# Altium schematic sheet RK3566.SchDoc
size A0; SheetNumber: 13; SheetTotal: 22
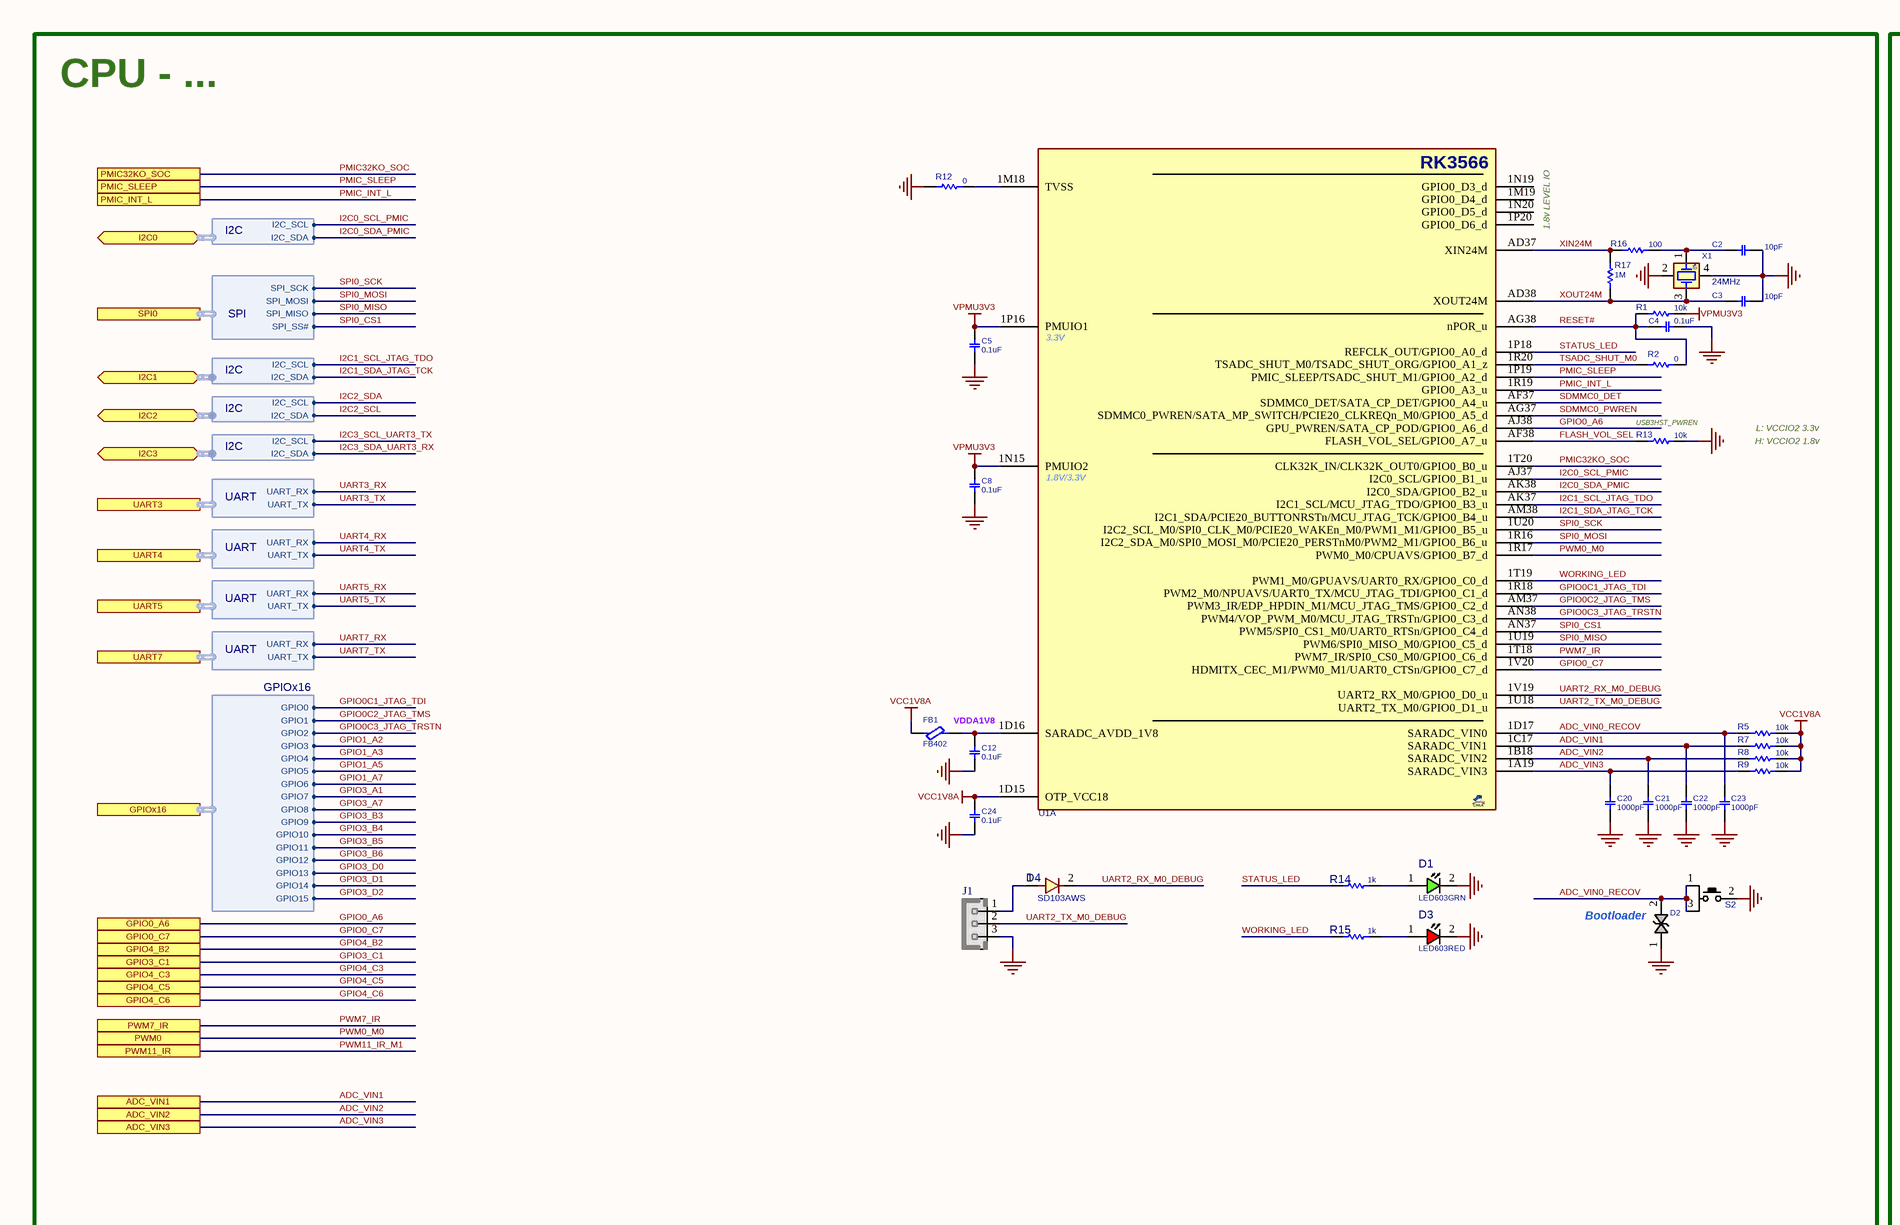
[diagram p0: RK3566.SchDoc, top left]
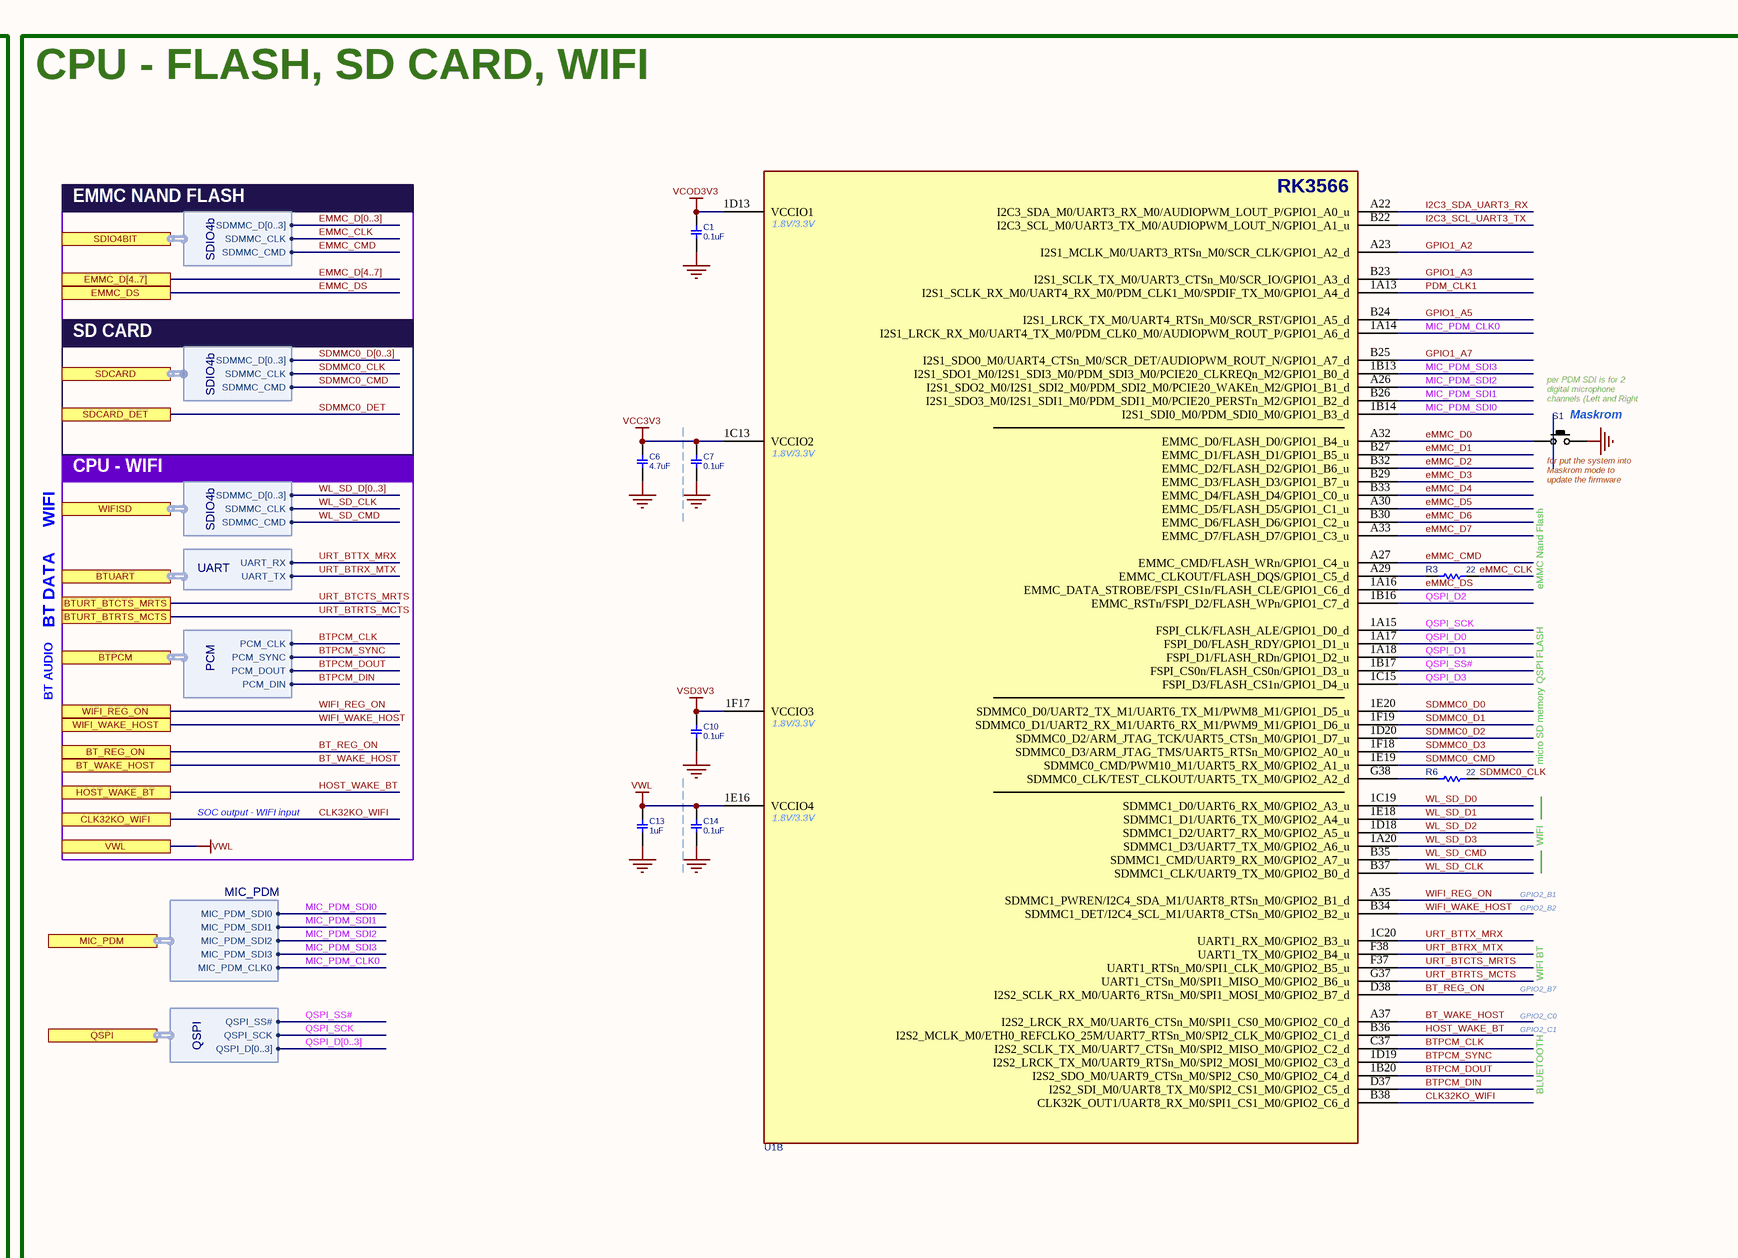
[diagram p1: RK3566.SchDoc, top middle]
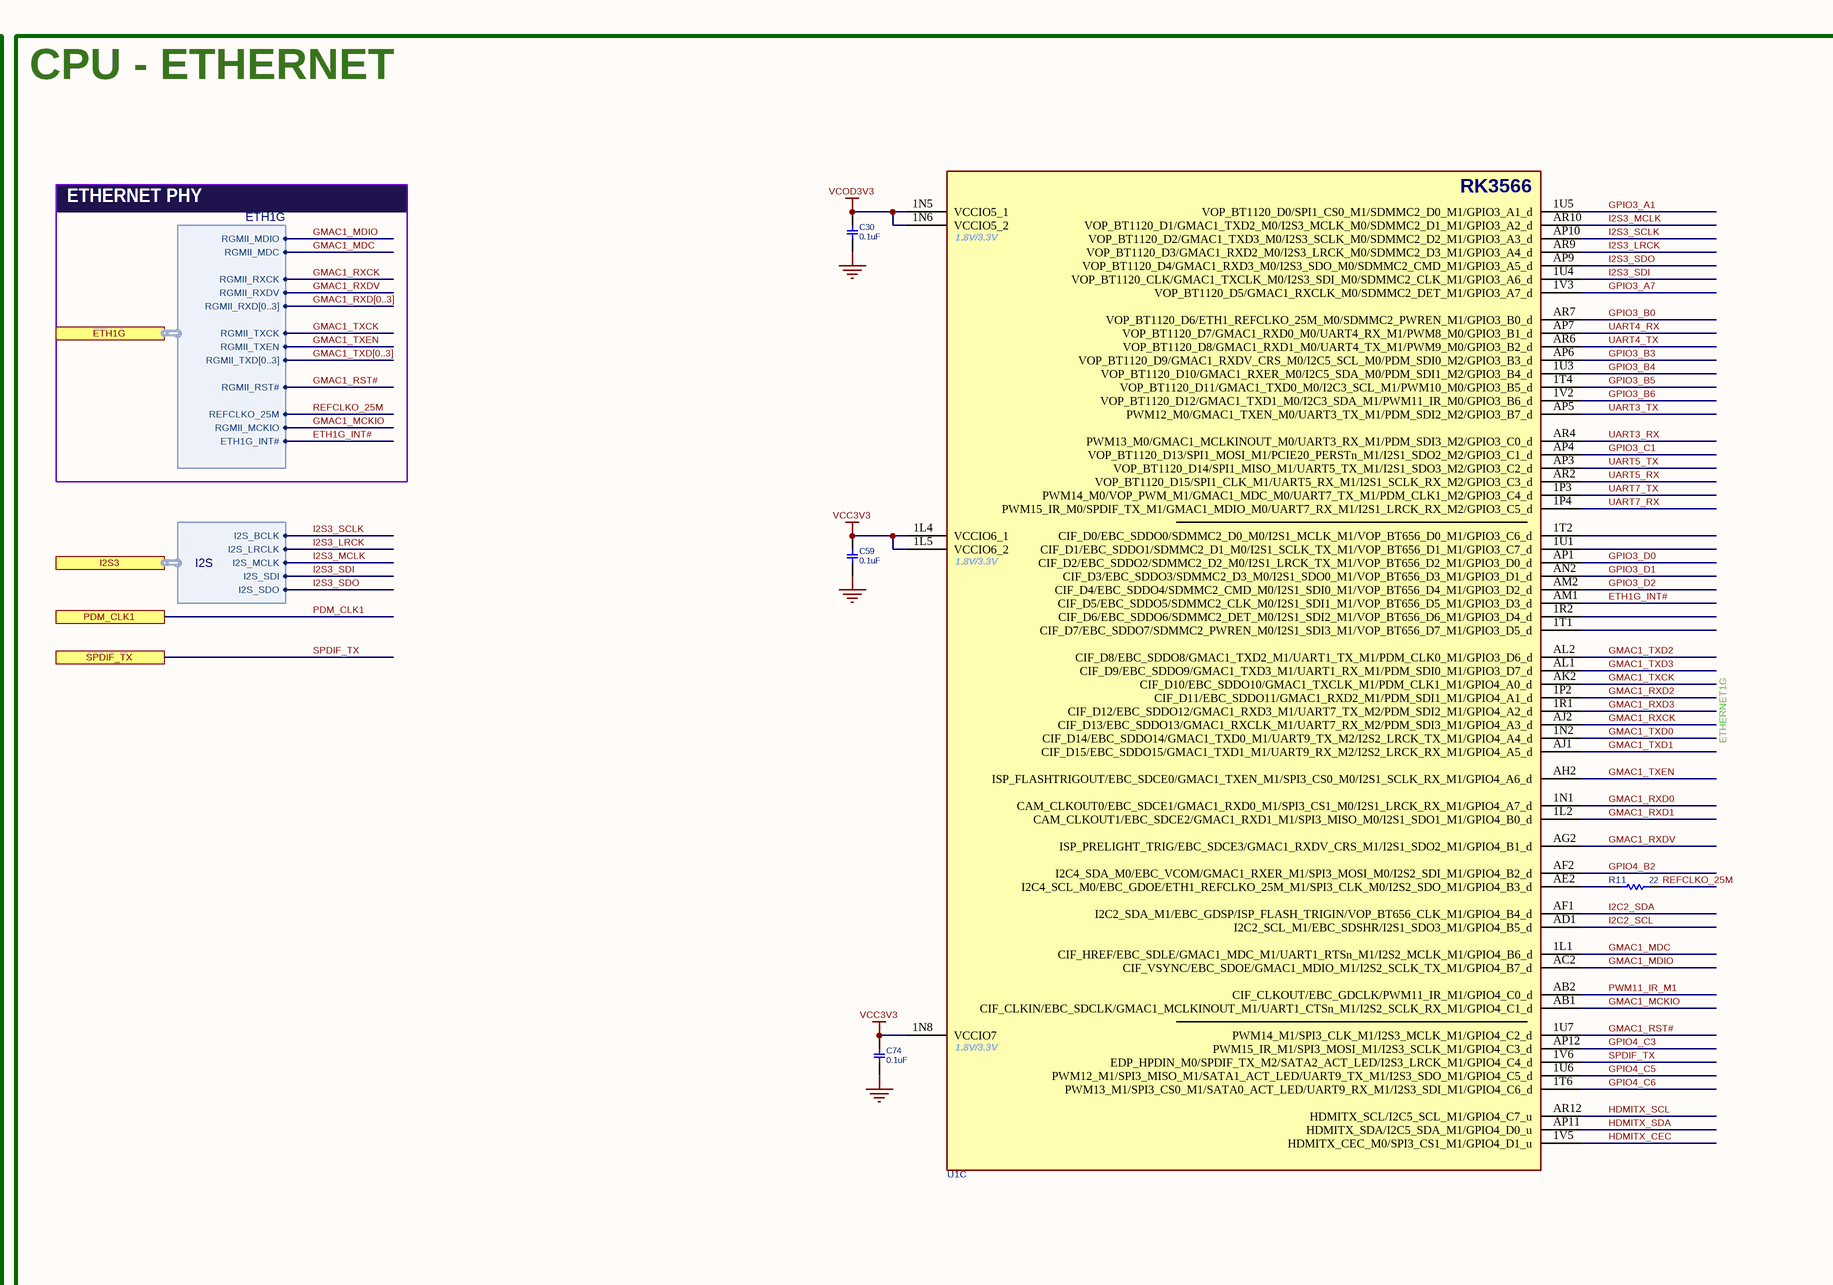
[diagram p2: RK3566.SchDoc, top right]
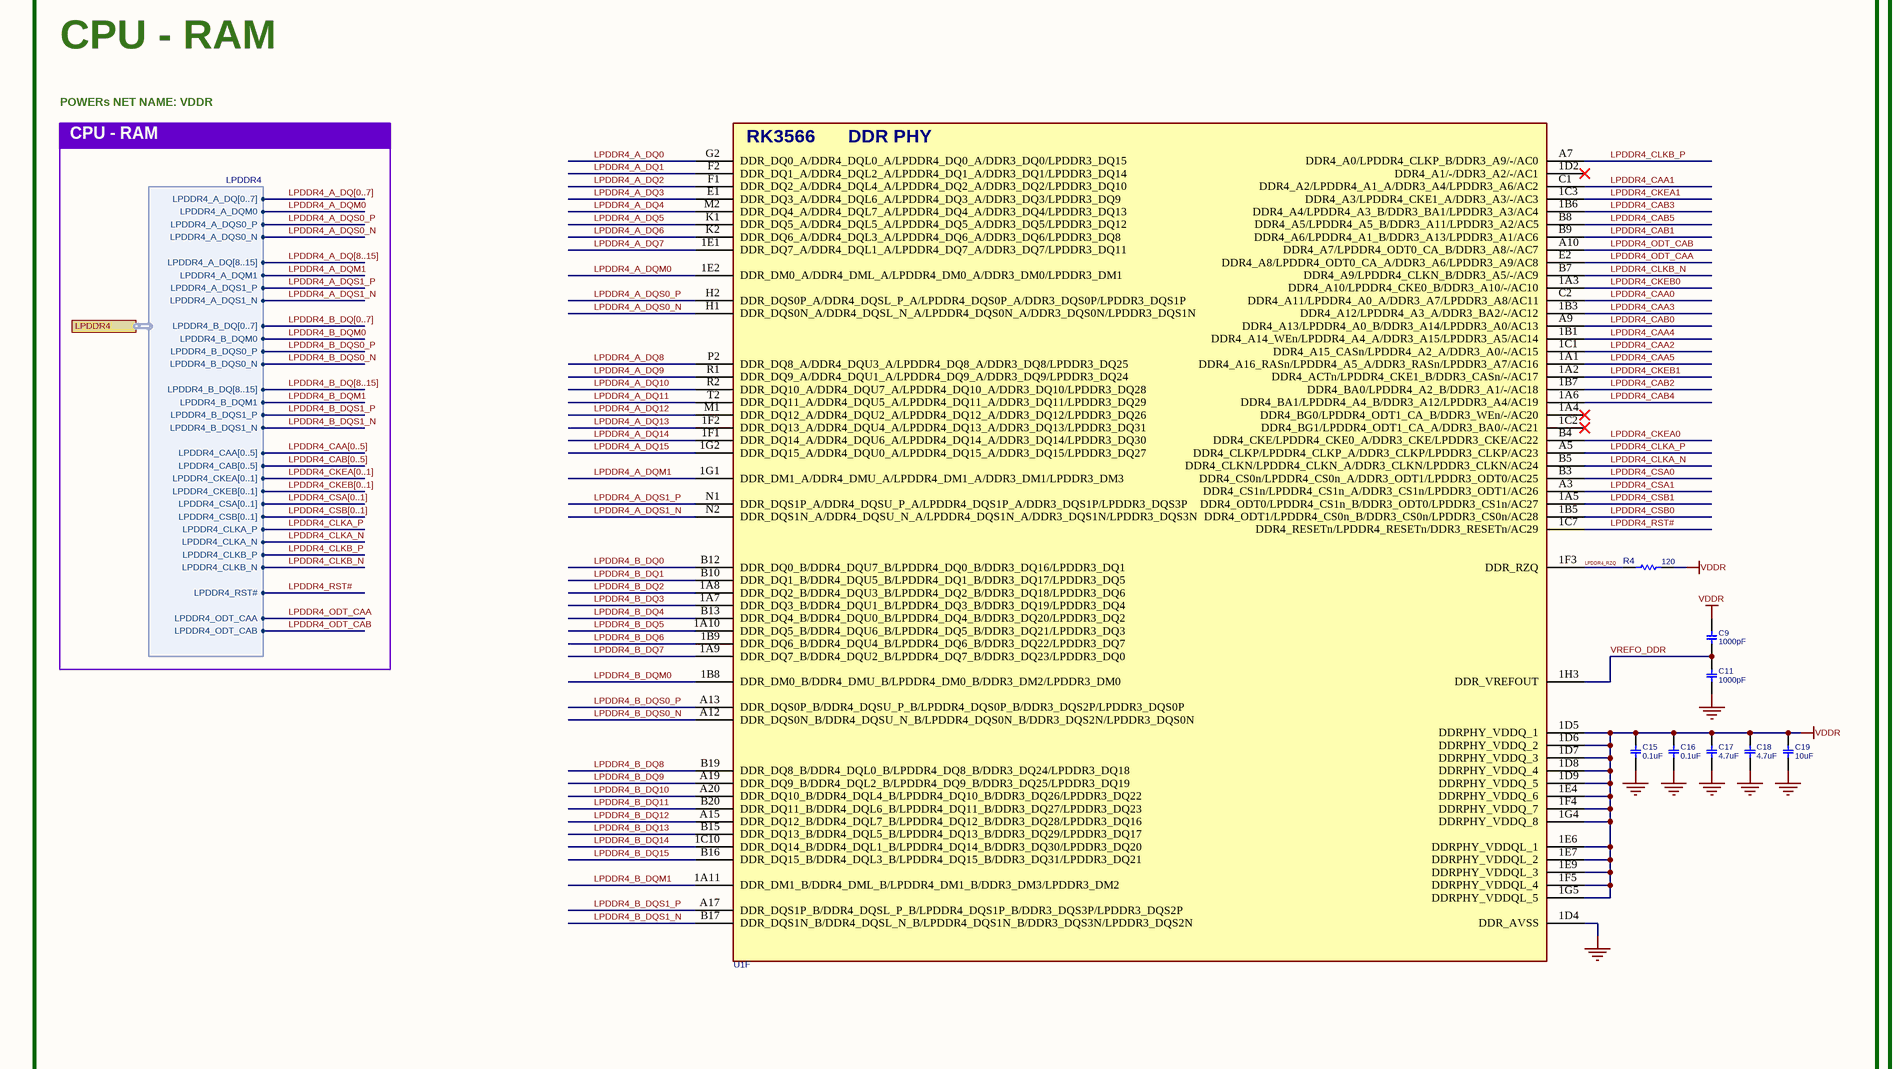
[diagram p3: RK3566.SchDoc, bottom left]
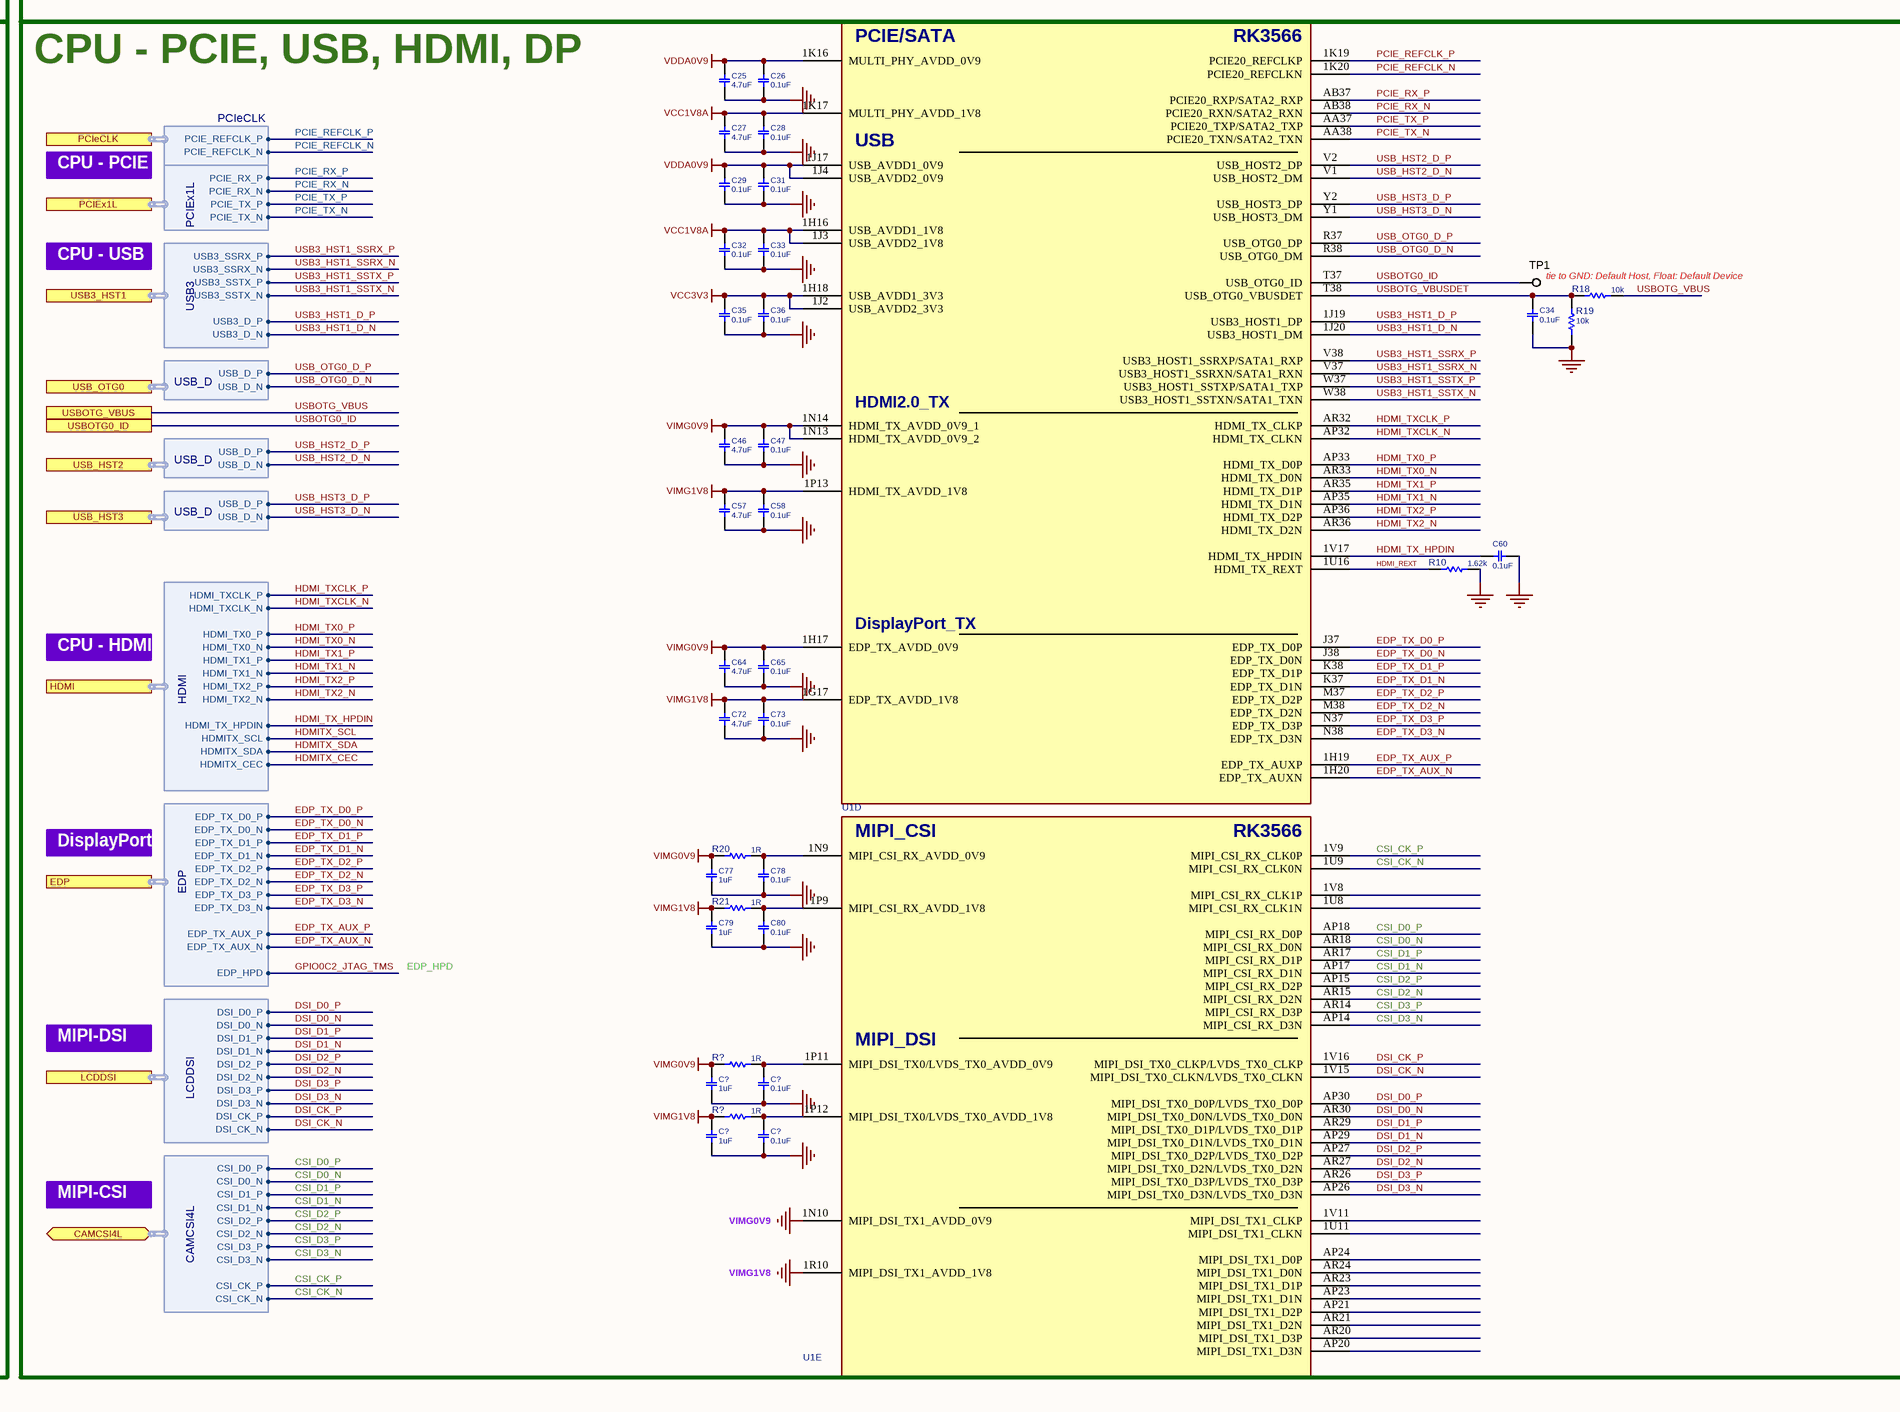
[diagram p4: RK3566.SchDoc, bottom middle]
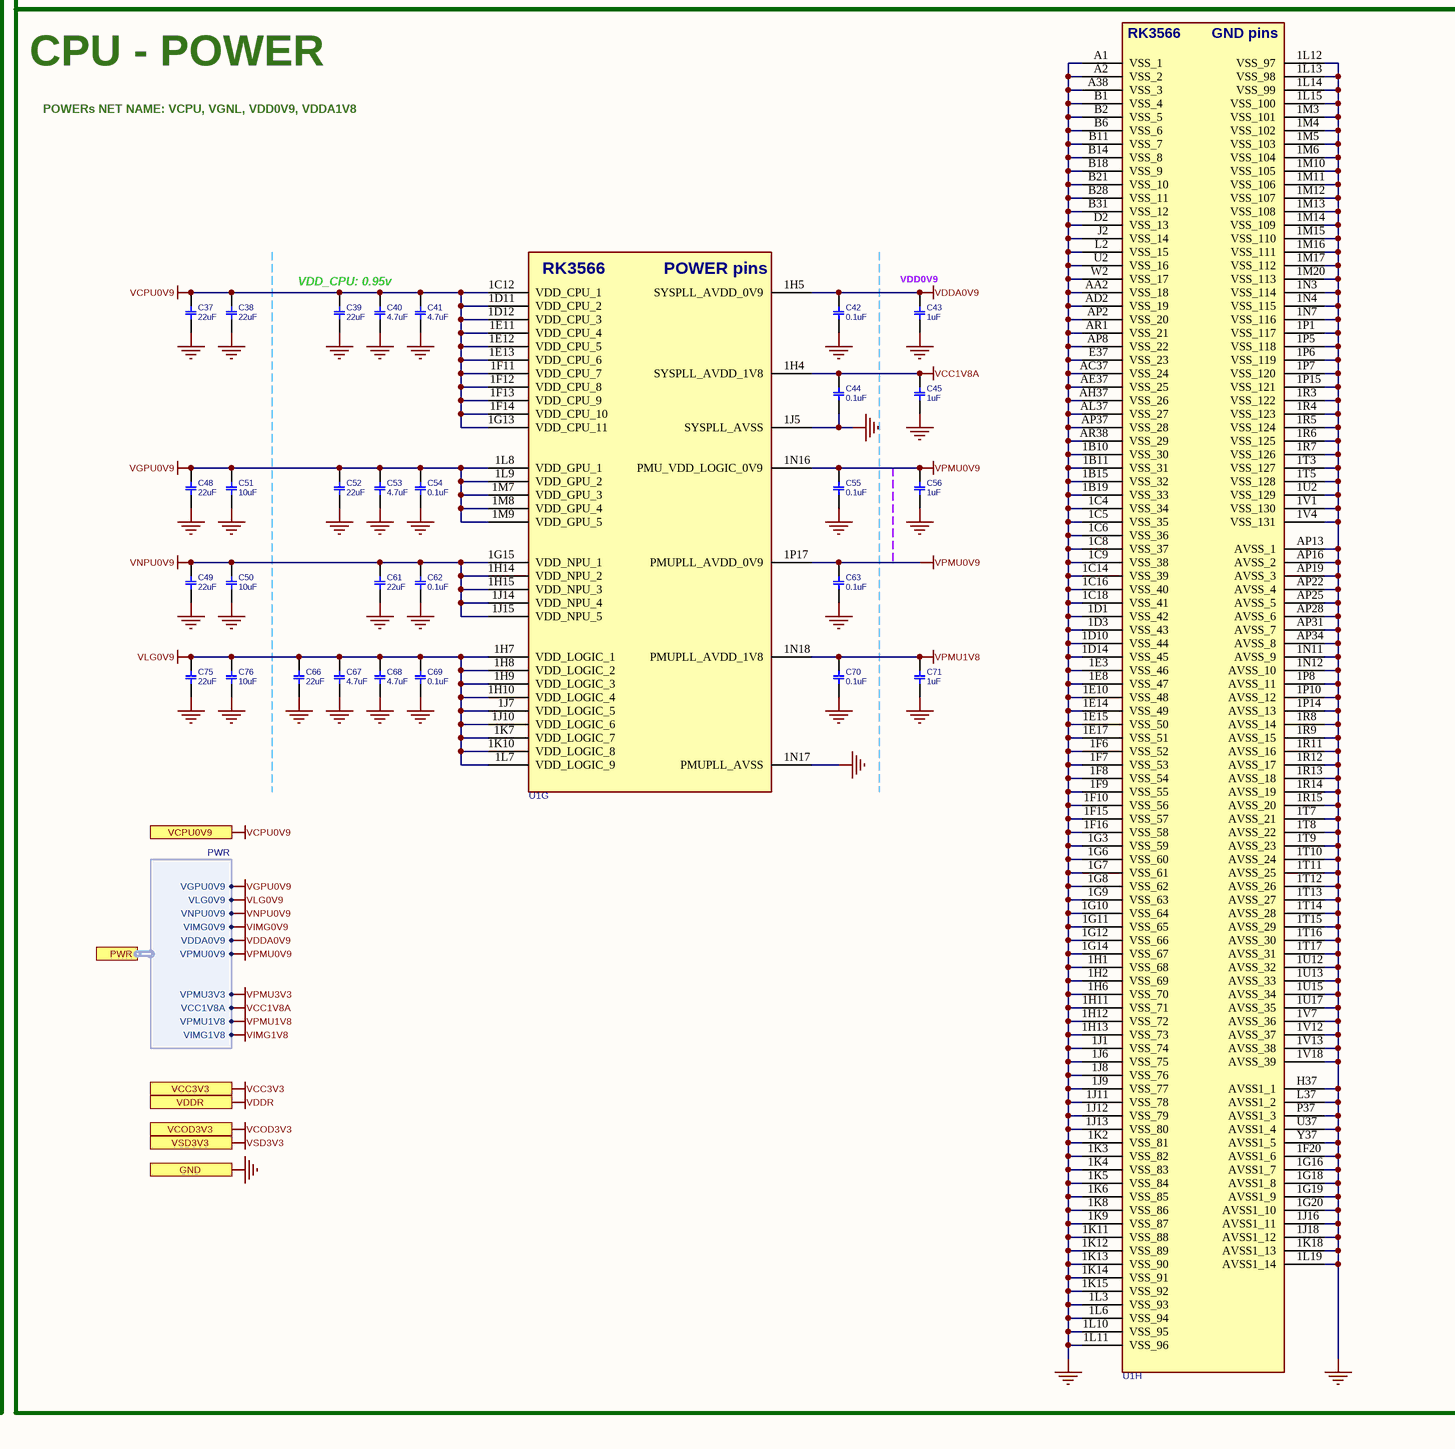
[diagram p5: RK3566.SchDoc, bottom right]

## Parts
(Parts that share a designator on the sheet are numbered #1, #2 ... from top to bottom, then left to right.)
C1  0.1uF  [C0201]
C2  10pF  [C0402A]
C3  10pF  [C0402A]
C4  0.1uF  [C0402A]
C5  0.1uF  [C0201]
C6  4.7uF  [C0201]
C7  0.1uF  [C0201]
C8  0.1uF  [C0201]
C9  1000pF  [C0201]
C10  0.1uF  [C0201]
C11  1000pF  [C0201]
C12  0.1uF  [C0201]
C13  1uF  [C0201]
C14  0.1uF  [C0201]
C15  0.1uF  [C0201]
C16  0.1uF  [C0201]
C17  4.7uF  [C0201]
C18  4.7uF  [C0201]
C19  10uF  [C0402A]
C20  1000pF  [C0201]
C21  1000pF  [C0201]
C22  1000pF  [C0201]
C23  1000pF  [C0201]
C24  0.1uF  [C0201]
C25  4.7uF  [C0201]
C26  0.1uF  [C0201]
C27  4.7uF  [C0201]
C28  0.1uF  [C0201]
C29  0.1uF  [C0201]
C30  0.1uF  [C0201]
C31  0.1uF  [C0201]
C32  0.1uF  [C0201]
C33  0.1uF  [C0201]
C34  0.1uF  [C0402A]
C35  0.1uF  [C0201]
C36  0.1uF  [C0201]
C37  22uF  [C0402A]
C38  22uF  [C0402A]
C39  22uF  [C0402A]
C40  4.7uF  [C0201]
C41  4.7uF  [C0201]
C42  0.1uF  [C0201]
C43  1uF  [C0201]
C44  0.1uF  [C0201]
C45  1uF  [C0201]
C46  4.7uF  [C0201]
C47  0.1uF  [C0201]
C48  22uF  [C0402A]
C49  22uF  [C0402A]
C50  10uF  [C0402A]
C51  10uF  [C0402A]
C52  22uF  [C0402A]
C53  4.7uF  [C0201]
C54  0.1uF  [C0201]
C55  0.1uF  [C0201]
C56  1uF  [C0201]
C57  4.7uF  [C0201]
C58  0.1uF  [C0201]
C59  0.1uF  [C0201]
C60  0.1uF  [C0201]
C61  22uF  [C0402A]
C62  0.1uF  [C0201]
C63  0.1uF  [C0201]
C64  4.7uF  [C0201]
C65  0.1uF  [C0201]
C66  22uF  [C0402A]
C67  4.7uF  [C0201]
C68  4.7uF  [C0201]
C69  0.1uF  [C0201]
C70  0.1uF  [C0201]
C71  1uF  [C0201]
C72  4.7uF  [C0201]
C73  0.1uF  [C0201]
C74  0.1uF  [C0201]
C75  22uF  [C0402A]
C76  10uF  [C0402A]
C77  1uF  [C0201]
C78  0.1uF  [C0201]
C79  1uF  [C0201]
C80  0.1uF  [C0201]
C?#1  1uF  [C0201]
C?#2  0.1uF  [C0201]
C?#3  1uF  [C0201]
C?#4  0.1uF  [C0201]
D1  LED603GRN  [LED0603GRN]
D2  TVS_PESDNC2FD3V3  [ESD0402]  (value not drawn)
D3  LED603RED  [LED0603RED]
D4  SD103AWS  [D_SOD323]
FB1  FB402  [L0402A]
J1  HHDR_3  [XH_3]  (value not drawn)
R1  10k  [R0402A]
R2  0  [R0402A]
R3  22  [R0402]
R4  120  [R0402A]
R5  10k  [R0402A]
R6  22  [R0402]
R7  10k  [R0402A]
R8  10k  [R0402A]
R9  10k  [R0402A]
R10  1.62k  [R0402A]
R11  22  [R0402]
R12  0  [R0402A]
R13  10k  [R0402A]
R14  1k  [R0402A]
R15  1k  [R0402A]
R16  100  [R0402A]
R17  1M  [R0402A]
R18  10k  [R0402A]
R19  10k  [R0402A]
R20  1R  [R0402A]
R21  1R  [R0402A]
R?#1  1R  [R0402A]
R?#2  1R  [R0402A]
S1  PUSHBUTTON  [SWPBS_SPST_3X2X1]  (value not drawn)
S2  PUSHBUTTON  [SWPBS_SPDT_R_SKRTLA]  (value not drawn)
TP1  TESTPOINT_SMD  [TPSMD_S1]  (value not drawn)  (no BOM)
U1  RK3566  [BGA65_565]  (value not drawn)  (parts A,B,C,D,E,F,G,H of 8)
X1  24MHz  [XTL_4_2016]

## Blocks framed on the sheet
CPU - ...: C2-C5 C8 C12 C20-C24 D1-D4 FB1 J1 R1 R2 R5 R7-R9 R12-R17 S2 U1 X1
CPU - FLASH, SD CARD, WIFI: C1 C6 C7 C10 C13 C14 R3 R6 S1 U1
CPU - ETHERNET: C30 C59 C74 R11 U1
CPU - RAM: C9 C11 C15-C19 R4 U1
CPU - PCIE, USB, HDMI, DP: C25-C29 C31-C36 C46 C47 C57 C58 C60 C64 C65 C72 C73 C77-C80 C?#1-C?#4 R10 R18-R21 R?#1 R?#2 TP1 U1
CPU - POWER: C37-C45 C48-C56 C61-C63 C66-C71 C75 C76 U1

## Ports
ADC_VIN1, ADC_VIN2, ADC_VIN3, BT_REG_ON, BT_WAKE_HOST, BTPCM (harness PCM), BTUART (harness UART), BTURT_BTCTS_MRTS, BTURT_BTRTS_MCTS, CAMCSI4L (bidir, harness CAMCSI4L), CLK32KO_WIFI, EDP (harness EDP), EMMC_D[4..7], EMMC_DS, ETH1G (harness ETH1G), GND, GPIO0_A6, GPIO0_C7, GPIO3_C1, GPIO4_B2, GPIO4_C3, GPIO4_C5, GPIO4_C6, GPIOx16 (harness GPIOx16), HDMI (harness HDMI), HOST_WAKE_BT, I2C0 (bidir, harness I2C), I2C1 (bidir, harness I2C), I2C2 (bidir, harness I2C), I2C3 (bidir, harness I2C), I2S3 (harness I2S), LCDDSI (harness LCDDSI), LPDDR4 (harness LPDDR4), MIC_PDM (harness MIC_PDM), PCIeCLK (harness PCIeCLK), PCIEx1L (harness PCIEx1L), PDM_CLK1, PMIC32KO_SOC, PMIC_INT_L, PMIC_SLEEP, PWM0, PWM7_IR, PWM11_IR, PWR (harness PWR), QSPI (harness QSPI), SDCARD (harness SDIO4b), SDCARD_DET, SDIO4BIT (harness SDIO4b), SPDIF_TX, SPI0 (harness SPI), UART3 (harness UART), UART4 (harness UART), UART5 (harness UART), UART7 (harness UART), USB3_HST1 (harness USB3), USB_HST2 (harness USB_D), USB_HST3 (harness USB_D), USB_OTG0 (harness USB_D), USBOTG0_ID, USBOTG_VBUS, VCC3V3, VCOD3V3, VCPU0V9, VDDR, VSD3V3, VWL, WIFI_REG_ON, WIFI_WAKE_HOST, WIFISD (harness SDIO4b)

## Harnesses
LPDDR4: LPDDR4_A_DQ[0..7], LPDDR4_A_DQM0, LPDDR4_A_DQS0_P, LPDDR4_A_DQS0_N, LPDDR4_A_DQ[8..15], LPDDR4_A_DQM1, LPDDR4_A_DQS1_P, LPDDR4_A_DQS1_N, LPDDR4_B_DQ[0..7], LPDDR4_B_DQM0, LPDDR4_B_DQS0_P, LPDDR4_B_DQS0_N, LPDDR4_B_DQ[8..15], LPDDR4_B_DQM1, LPDDR4_B_DQS1_P, LPDDR4_B_DQS1_N, LPDDR4_CAA[0..5], LPDDR4_CAB[0..5], LPDDR4_CKEA[0..1], LPDDR4_CKEB[0..1], LPDDR4_CSA[0..1], LPDDR4_CSB[0..1], LPDDR4_CLKA_P, LPDDR4_CLKA_N, LPDDR4_CLKB_P, LPDDR4_CLKB_N, LPDDR4_RST#, LPDDR4_ODT_CAA, LPDDR4_ODT_CAB
HDMI: HDMI_TXCLK_P, HDMI_TXCLK_N, HDMI_TX0_P, HDMI_TX0_N, HDMI_TX1_P, HDMI_TX1_N, HDMI_TX2_P, HDMI_TX2_N, HDMI_TX_HPDIN, HDMITX_SCL, HDMITX_SDA, HDMITX_CEC
PWR: VGPU0V9, VLG0V9, VNPU0V9, VIMG0V9, VDDA0V9, VPMU0V9, VPMU3V3, VCC1V8A, VPMU1V8, VIMG1V8
EDP: EDP_TX_D0_P, EDP_TX_D0_N, EDP_TX_D1_P, EDP_TX_D1_N, EDP_TX_D2_P, EDP_TX_D2_N, EDP_TX_D3_P, EDP_TX_D3_N, EDP_TX_AUX_P, EDP_TX_AUX_N, EDP_HPD
MIC_PDM: MIC_PDM_SDI0, MIC_PDM_SDI1, MIC_PDM_SDI2, MIC_PDM_SDI3, MIC_PDM_CLK0
USB3: USB3_SSRX_P, USB3_SSRX_N, USB3_SSTX_P, USB3_SSTX_N, USB3_D_P, USB3_D_N
PCIEx1L: PCIE_RX_P, PCIE_RX_N, PCIE_TX_P, PCIE_TX_N
ETH1G: RGMII_MDIO, RGMII_MDC, RGMII_RXCK, RGMII_RXDV, RGMII_RXD[0..3], RGMII_TXCK, RGMII_TXEN, RGMII_TXD[0..3], RGMII_RST#, REFCLKO_25M, RGMII_MCKIO, ETH1G_INT#
CAMCSI4L: CSI_D0_P, CSI_D0_N, CSI_D1_P, CSI_D1_N, CSI_CK_P, CSI_CK_N, CSI_D2_P, CSI_D2_N, CSI_D3_P, CSI_D3_N
LCDDSI: DSI_D0_P, DSI_D0_N, DSI_D1_P, DSI_D1_N, DSI_D2_P, DSI_D2_N, DSI_D3_P, DSI_D3_N, DSI_CK_P, DSI_CK_N
QSPI: QSPI_SS#, QSPI_SCK, QSPI_D[0..3]
SDIO4b: SDMMC_CMD, SDMMC_D[0..3], SDMMC_CLK
USB_D: USB_D_P, USB_D_N
I2C: I2C_SCL, I2C_SDA
SPI: SPI_SCK, SPI_MOSI, SPI_MISO, SPI_SS#
UART: UART_RX, UART_TX
GPIOx16: GPIO0, GPIO1, GPIO2, GPIO3, GPIO4, GPIO5, GPIO6, GPIO7, GPIO8, GPIO9, GPIO10, GPIO11, GPIO12, GPIO13, GPIO14, GPIO15
PCM: PCM_CLK, PCM_SYNC, PCM_DOUT, PCM_DIN
I2S: I2S_BCLK, I2S_LRCLK, I2S_MCLK, I2S_SDI, I2S_SDO
PCIeCLK: PCIE_REFCLK_P, PCIE_REFCLK_N

## Nets
GND: C1.2 C2.2 C3.2 C4.1 C5.2 C6.1 C7.2 C8.2 C10.2 C11.2 C12.2 C13.1 C14.2 C15.1 C16.1 C17.1 C18.1 C19.1 C20.2 C21.2 C22.2 C23.2 C24.2 C25.1 C26.2 C27.1 C28.2 C29.2 C30.2 C31.2 C32.2 C33.2 C34.2 C35.2 C36.2 C37.1 C38.1 C39.1 C40.1 C41.1 C42.1 C43.1 C44.1 C45.1 C46.1 C47.2 C48.1 C49.1 C50.1 C51.1 C52.1 C53.1 C54.1 C55.1 C56.1 C57.1 C58.2 C59.2 C60.2 C61.1 C62.1 C63.1 C64.1 C65.2 C66.1 C67.1 C68.1 C69.1 C70.1 C71.1 C72.1 C73.2 C74.2 C75.1 C76.1 C77.1 C78.1 C79.1 C80.1 C?#1.1 C?#2.1 C?#3.1 C?#4.1 D1.2(CATHODE) D2.1 D3.2(CATHODE) J1.3 R10.1 R12.2 R13.1 R19.2 S1.1(P1) S2.2 U1.1B10(VSS_30) U1.1B11(VSS_31) U1.1B15(VSS_32) U1.1B19(VSS_33) U1.1C4(VSS_34) U1.1C5(VSS_35) U1.1C6(VSS_36) U1.1C8(VSS_37) U1.1C9(VSS_38) U1.1C14(VSS_39) U1.1C16(VSS_40) U1.1C18(VSS_41) U1.1D1(VSS_42) U1.1D3(VSS_43) U1.1D4(DDR_AVSS) U1.1D10(VSS_44) U1.1D14(VSS_45) U1.1E3(VSS_46) U1.1E8(VSS_47) U1.1E10(VSS_48) U1.1E14(VSS_49) U1.1E15(VSS_50) U1.1E17(VSS_51) U1.1F6(VSS_52) U1.1F7(VSS_53) U1.1F8(VSS_54) U1.1F9(VSS_55) U1.1F10(VSS_56) U1.1F15(VSS_57) U1.1F16(VSS_58) U1.1F20(AVSS1_6) U1.1G3(VSS_59) U1.1G6(VSS_60) U1.1G7(VSS_61) U1.1G8(VSS_62) U1.1G9(VSS_63) U1.1G10(VSS_64) U1.1G11(VSS_65) U1.1G12(VSS_66) U1.1G14(VSS_67) U1.1G16(AVSS1_7) U1.1G18(AVSS1_8) U1.1G19(AVSS1_9) U1.1G20(AVSS1_10) U1.1H1(VSS_68) U1.1H2(VSS_69) U1.1H6(VSS_70) U1.1H11(VSS_71) U1.1H12(VSS_72) U1.1H13(VSS_73) U1.1J1(VSS_74) U1.1J5(SYSPLL_AVSS) U1.1J6(VSS_75) U1.1J8(VSS_76) U1.1J9(VSS_77) U1.1J11(VSS_78) U1.1J12(VSS_79) U1.1J13(VSS_80) U1.1J16(AVSS1_11) U1.1J18(AVSS1_12) U1.1K2(VSS_81) U1.1K3(VSS_82) U1.1K4(VSS_83) U1.1K5(VSS_84) U1.1K6(VSS_85) U1.1K8(VSS_86) U1.1K9(VSS_87) U1.1K11(VSS_88) U1.1K12(VSS_89) U1.1K13(VSS_90) U1.1K14(VSS_91) U1.1K15(VSS_92) U1.1K18(AVSS1_13) U1.1L3(VSS_93) U1.1L6(VSS_94) U1.1L10(VSS_95) U1.1L11(VSS_96) U1.1L12(VSS_97) U1.1L13(VSS_98) U1.1L14(VSS_99) U1.1L15(VSS_100) U1.1L19(AVSS1_14) U1.1M3(VSS_101) U1.1M4(VSS_102) U1.1M5(VSS_103) U1.1M6(VSS_104) U1.1M10(VSS_105) U1.1M11(VSS_106) U1.1M12(VSS_107) U1.1M13(VSS_108) U1.1M14(VSS_109) U1.1M15(VSS_110) U1.1M16(VSS_111) U1.1M17(VSS_112) U1.1M20(VSS_113) U1.1N3(VSS_114) U1.1N4(VSS_115) U1.1N7(VSS_116) U1.1N10(MIPI_DSI_TX1_AVDD_0V9) U1.1N11(AVSS_9) U1.1N12(AVSS_10) U1.1N17(PMUPLL_AVSS) U1.1P1(VSS_117) U1.1P5(VSS_118) U1.1P6(VSS_119) U1.1P7(VSS_120) U1.1P8(AVSS_11) U1.1P10(AVSS_12) U1.1P14(AVSS_13) U1.1P15(VSS_121) U1.1R3(VSS_122) U1.1R4(VSS_123) U1.1R5(VSS_124) U1.1R6(VSS_125) U1.1R7(VSS_126) U1.1R8(AVSS_14) U1.1R9(AVSS_15) U1.1R10(MIPI_DSI_TX1_AVDD_1V8) U1.1R11(AVSS_16) U1.1R12(AVSS_17) U1.1R13(AVSS_18) U1.1R14(AVSS_19) U1.1R15(AVSS_20) U1.1T3(VSS_127) U1.1T5(VSS_128) U1.1T7(AVSS_21) U1.1T8(AVSS_22) U1.1T9(AVSS_23) U1.1T10(AVSS_24) U1.1T11(AVSS_25) U1.1T12(AVSS_26) U1.1T13(AVSS_27) U1.1T14(AVSS_28) U1.1T15(AVSS_29) U1.1T16(AVSS_30) U1.1T17(AVSS_31) U1.1U2(VSS_129) U1.1U12(AVSS_32) U1.1U13(AVSS_33) U1.1U15(AVSS_34) U1.1U17(AVSS_35) U1.1V1(VSS_130) U1.1V4(VSS_131) U1.1V7(AVSS_36) U1.1V12(AVSS_37) U1.1V13(AVSS_38) U1.1V18(AVSS_39) U1.A1(VSS_1) U1.A2(VSS_2) U1.A38(VSS_3) U1.AA2(VSS_18) U1.AC37(VSS_24) U1.AD2(VSS_19) U1.AE37(VSS_25) U1.AH37(VSS_26) U1.AL37(VSS_27) U1.AP2(VSS_20) U1.AP8(VSS_22) U1.AP13(AVSS_1) U1.AP16(AVSS_2) U1.AP19(AVSS_3) U1.AP22(AVSS_4) U1.AP25(AVSS_5) U1.AP28(AVSS_6) U1.AP31(AVSS_7) U1.AP34(AVSS_8) U1.AP37(VSS_28) U1.AR1(VSS_21) U1.AR38(VSS_29) U1.B1(VSS_4) U1.B2(VSS_5) U1.B6(VSS_6) U1.B11(VSS_7) U1.B14(VSS_8) U1.B18(VSS_9) U1.B21(VSS_10) U1.B28(VSS_11) U1.B31(VSS_12) U1.D2(VSS_13) U1.E37(VSS_23) U1.H37(AVSS1_1) U1.J2(VSS_14) U1.L2(VSS_15) U1.L37(AVSS1_2) U1.P37(AVSS1_3) U1.U2(VSS_16) U1.U37(AVSS1_4) U1.W2(VSS_17) U1.Y37(AVSS1_5) X1.2 X1.4 ; port GND
VCC1V8A: C24.1 C27.2 C28.1 C32.1 C33.1 C44.2 C45.2 FB1.1 R5.1 R7.1 R8.1 R9.1 U1.1D15(OTP_VCC18) U1.1H4(SYSPLL_AVDD_1V8) U1.1H16(USB_AVDD1_1V8) U1.1J3(USB_AVDD2_1V8) U1.1K17(MULTI_PHY_AVDD_1V8) ; port PWR.VCC1V8A
VCC3V3: C6.2 C7.1 C35.1 C36.1 C59.1 C74.1 U1.1C13(VCCIO2) U1.1H18(USB_AVDD1_3V3) U1.1J2(USB_AVDD2_3V3) U1.1L4(VCCIO6_1) U1.1L5(VCCIO6_2) U1.1N8(VCCIO7) ; port VCC3V3
VCOD3V3: C1.1 C30.1 U1.1D13(VCCIO1) U1.1N5(VCCIO5_1) U1.1N6(VCCIO5_2) ; port VCOD3V3
VCPU0V9: C37.2 C38.2 C39.2 C40.2 C41.2 U1.1C12(VDD_CPU_1) U1.1D11(VDD_CPU_2) U1.1D12(VDD_CPU_3) U1.1E11(VDD_CPU_4) U1.1E12(VDD_CPU_5) U1.1E13(VDD_CPU_6) U1.1F11(VDD_CPU_7) U1.1F12(VDD_CPU_8) U1.1F13(VDD_CPU_9) U1.1F14(VDD_CPU_10) U1.1G13(VDD_CPU_11) ; port VCPU0V9
VDDA0V9: C25.2 C26.1 C29.1 C31.1 C42.2 C43.2 U1.1H5(SYSPLL_AVDD_0V9) U1.1J4(USB_AVDD2_0V9) U1.1J17(USB_AVDD1_0V9) U1.1K16(MULTI_PHY_AVDD_0V9) ; port PWR.VDDA0V9
VDDR: C9.1 C15.2 C16.2 C17.2 C18.2 C19.2 R4.1 U1.1D5(DDRPHY_VDDQ_1) U1.1D6(DDRPHY_VDDQ_2) U1.1D7(DDRPHY_VDDQ_3) U1.1D8(DDRPHY_VDDQ_4) U1.1D9(DDRPHY_VDDQ_5) U1.1E4(DDRPHY_VDDQ_6) U1.1E6(DDRPHY_VDDQL_1) U1.1E7(DDRPHY_VDDQL_2) U1.1E9(DDRPHY_VDDQL_3) U1.1F4(DDRPHY_VDDQ_7) U1.1F5(DDRPHY_VDDQL_4) U1.1G4(DDRPHY_VDDQ_8) U1.1G5(DDRPHY_VDDQL_5) ; port VDDR
VGPU0V9: C48.2 C51.2 C52.2 C53.2 C54.2 U1.1L8(VDD_GPU_1) U1.1L9(VDD_GPU_2) U1.1M7(VDD_GPU_3) U1.1M8(VDD_GPU_4) U1.1M9(VDD_GPU_5) ; port PWR.VGPU0V9
VIMG0V9: C46.2 C47.1 C64.2 C65.1 C77.2 C?#1.2 R20.1 R?#1.1 U1.1H17(EDP_TX_AVDD_0V9) U1.1N13(HDMI_TX_AVDD_0V9_2) U1.1N14(HDMI_TX_AVDD_0V9_1) ; port PWR.VIMG0V9
VIMG1V8: C57.2 C58.1 C72.2 C73.1 C79.2 C?#3.2 R21.1 R?#2.1 U1.1G17(EDP_TX_AVDD_1V8) U1.1P13(HDMI_TX_AVDD_1V8) ; port PWR.VIMG1V8
VLG0V9: C66.2 C67.2 C68.2 C69.2 C75.2 C76.2 U1.1H7(VDD_LOGIC_1) U1.1H8(VDD_LOGIC_2) U1.1H9(VDD_LOGIC_3) U1.1H10(VDD_LOGIC_4) U1.1J7(VDD_LOGIC_5) U1.1J10(VDD_LOGIC_6) U1.1K7(VDD_LOGIC_7) U1.1K10(VDD_LOGIC_8) U1.1L7(VDD_LOGIC_9) ; port PWR.VLG0V9
VNPU0V9: C49.2 C50.2 C61.2 C62.2 U1.1G15(VDD_NPU_1) U1.1H14(VDD_NPU_2) U1.1H15(VDD_NPU_3) U1.1J14(VDD_NPU_4) U1.1J15(VDD_NPU_5) ; port PWR.VNPU0V9
VPMU0V9: C55.2 C56.2 C63.2 U1.1N16(PMU_VDD_LOGIC_0V9) U1.1P17(PMUPLL_AVDD_0V9) ; port PWR.VPMU0V9
VPMU1V8: C70.2 C71.2 U1.1N18(PMUPLL_AVDD_1V8) ; port PWR.VPMU1V8
VPMU3V3: C5.1 C8.1 R1.1 U1.1N15(PMUIO2) U1.1P16(PMUIO1) ; port PWR.VPMU3V3
VSD3V3: C10.1 U1.1F17(VCCIO3) ; port VSD3V3
VWL: C13.2 C14.1 U1.1E16(VCCIO4) ; port VWL
ADC_VIN0_RECOV: C23.1 D2.2 R5.2 S2.1 S2.3 U1.1D17(SARADC_VIN0)
ADC_VIN1: C22.1 R7.2 U1.1C17(SARADC_VIN1) ; port ADC_VIN1
ADC_VIN2: C21.1 R8.2 U1.1B18(SARADC_VIN2) ; port ADC_VIN2
ADC_VIN3: C20.1 R9.2 U1.1A19(SARADC_VIN3) ; port ADC_VIN3
BT_REG_ON: U1.D38(I2S2_SCLK_RX_M0/UART6_RTSn_M0/SPI1_MOSI_M0/GPIO2_B7_d) ; port BT_REG_ON
BT_WAKE_HOST: U1.A37(I2S2_LRCK_RX_M0/UART6_CTSn_M0/SPI1_CS0_M0/GPIO2_C0_d) ; port BT_WAKE_HOST
BTPCM_CLK: U1.C37(I2S2_SCLK_TX_M0/UART7_CTSn_M0/SPI2_MISO_M0/GPIO2_C2_d) ; port BTPCM.PCM_CLK
BTPCM_DIN: U1.D37(I2S2_SDI_M0/UART8_TX_M0/SPI2_CS1_M0/GPIO2_C5_d) ; port BTPCM.PCM_DIN
BTPCM_DOUT: U1.1B20(I2S2_SDO_M0/UART9_CTSn_M0/SPI2_CS0_M0/GPIO2_C4_d) ; port BTPCM.PCM_DOUT
BTPCM_SYNC: U1.1D19(I2S2_LRCK_TX_M0/UART9_RTSn_M0/SPI2_MOSI_M0/GPIO2_C3_d) ; port BTPCM.PCM_SYNC
CLK32KO_WIFI: U1.B38(CLK32K_OUT1/UART8_RX_M0/SPI1_CS1_M0/GPIO2_C6_d) ; port CLK32KO_WIFI
CSI_CK_N: U1.1U9(MIPI_CSI_RX_CLK0N) ; port CAMCSI4L.CSI_CK_N
CSI_CK_P: U1.1V9(MIPI_CSI_RX_CLK0P) ; port CAMCSI4L.CSI_CK_P
CSI_D0_N: U1.AR18(MIPI_CSI_RX_D0N) ; port CAMCSI4L.CSI_D0_N
CSI_D0_P: U1.AP18(MIPI_CSI_RX_D0P) ; port CAMCSI4L.CSI_D0_P
CSI_D1_N: U1.AP17(MIPI_CSI_RX_D1N) ; port CAMCSI4L.CSI_D1_N
CSI_D1_P: U1.AR17(MIPI_CSI_RX_D1P) ; port CAMCSI4L.CSI_D1_P
CSI_D2_N: U1.AR15(MIPI_CSI_RX_D2N) ; port CAMCSI4L.CSI_D2_N
CSI_D2_P: U1.AP15(MIPI_CSI_RX_D2P) ; port CAMCSI4L.CSI_D2_P
CSI_D3_N: U1.AP14(MIPI_CSI_RX_D3N) ; port CAMCSI4L.CSI_D3_N
CSI_D3_P: U1.AR14(MIPI_CSI_RX_D3P) ; port CAMCSI4L.CSI_D3_P
DSI_CK_N: U1.1V15(MIPI_DSI_TX0_CLKN/LVDS_TX0_CLKN) ; port LCDDSI.DSI_CK_N
DSI_CK_P: U1.1V16(MIPI_DSI_TX0_CLKP/LVDS_TX0_CLKP) ; port LCDDSI.DSI_CK_P
DSI_D0_N: U1.AR30(MIPI_DSI_TX0_D0N/LVDS_TX0_D0N) ; port LCDDSI.DSI_D0_N
DSI_D0_P: U1.AP30(MIPI_DSI_TX0_D0P/LVDS_TX0_D0P) ; port LCDDSI.DSI_D0_P
DSI_D1_N: U1.AP29(MIPI_DSI_TX0_D1N/LVDS_TX0_D1N) ; port LCDDSI.DSI_D1_N
DSI_D1_P: U1.AR29(MIPI_DSI_TX0_D1P/LVDS_TX0_D1P) ; port LCDDSI.DSI_D1_P
DSI_D2_N: U1.AR27(MIPI_DSI_TX0_D2N/LVDS_TX0_D2N) ; port LCDDSI.DSI_D2_N
DSI_D2_P: U1.AP27(MIPI_DSI_TX0_D2P/LVDS_TX0_D2P) ; port LCDDSI.DSI_D2_P
DSI_D3_N: U1.AP26(MIPI_DSI_TX0_D3N/LVDS_TX0_D3N) ; port LCDDSI.DSI_D3_N
DSI_D3_P: U1.AR26(MIPI_DSI_TX0_D3P/LVDS_TX0_D3P) ; port LCDDSI.DSI_D3_P
EDP_TX_AUX_N: U1.1H20(EDP_TX_AUXN) ; port EDP.EDP_TX_AUX_N
EDP_TX_AUX_P: U1.1H19(EDP_TX_AUXP) ; port EDP.EDP_TX_AUX_P
EDP_TX_D0_N: U1.J38(EDP_TX_D0N) ; port EDP.EDP_TX_D0_N
EDP_TX_D0_P: U1.J37(EDP_TX_D0P) ; port EDP.EDP_TX_D0_P
EDP_TX_D1_N: U1.K37(EDP_TX_D1N) ; port EDP.EDP_TX_D1_N
EDP_TX_D1_P: U1.K38(EDP_TX_D1P) ; port EDP.EDP_TX_D1_P
EDP_TX_D2_N: U1.M38(EDP_TX_D2N) ; port EDP.EDP_TX_D2_N
EDP_TX_D2_P: U1.M37(EDP_TX_D2P) ; port EDP.EDP_TX_D2_P
EDP_TX_D3_N: U1.N38(EDP_TX_D3N) ; port EDP.EDP_TX_D3_N
EDP_TX_D3_P: U1.N37(EDP_TX_D3P) ; port EDP.EDP_TX_D3_P
eMMC_CLK: R3.1 ; port SDIO4BIT.SDMMC_CLK
eMMC_CMD: U1.A27(EMMC_CMD/FLASH_WRn/GPIO1_C4_u) ; port SDIO4BIT.SDMMC_CMD
eMMC_D0: S1.2(P3) U1.A32(EMMC_D0/FLASH_D0/GPIO1_B4_u)
eMMC_D1: U1.B27(EMMC_D1/FLASH_D1/GPIO1_B5_u)
eMMC_D2: U1.B32(EMMC_D2/FLASH_D2/GPIO1_B6_u)
eMMC_D3: U1.B29(EMMC_D3/FLASH_D3/GPIO1_B7_u)
eMMC_D4: U1.B33(EMMC_D4/FLASH_D4/GPIO1_C0_u)
eMMC_D5: U1.A30(EMMC_D5/FLASH_D5/GPIO1_C1_u)
eMMC_D6: U1.B30(EMMC_D6/FLASH_D6/GPIO1_C2_u)
eMMC_D7: U1.A33(EMMC_D7/FLASH_D7/GPIO1_C3_u)
eMMC_DS: U1.1A16(EMMC_DATA_STROBE/FSPI_CS1n/FLASH_CLE/GPIO1_C6_d) ; port EMMC_DS
ETH1G_INT#: U1.AM1(CIF_D5/EBC_SDDO5/SDMMC2_CLK_M0/I2S1_SDI1_M1/VOP_BT656_D5_M1/GPIO3_D3_d) ; port ETH1G.ETH1G_INT#
FLASH_VOL_SEL: R13.2 U1.AF38(FLASH_VOL_SEL/GPIO0_A7_u)
GMAC1_MCKIO: U1.AB1(CIF_CLKIN/EBC_SDCLK/GMAC1_MCLKINOUT_M1/UART1_CTSn_M1/I2S2_SCLK_RX_M1/GPIO4_C1_d) ; port ETH1G.RGMII_MCKIO
GMAC1_MDC: U1.1L1(CIF_HREF/EBC_SDLE/GMAC1_MDC_M1/UART1_RTSn_M1/I2S2_MCLK_M1/GPIO4_B6_d) ; port ETH1G.RGMII_MDC
GMAC1_MDIO: U1.AC2(CIF_VSYNC/EBC_SDOE/GMAC1_MDIO_M1/I2S2_SCLK_TX_M1/GPIO4_B7_d) ; port ETH1G.RGMII_MDIO
GMAC1_RST#: U1.1U7(PWM14_M1/SPI3_CLK_M1/I2S3_MCLK_M1/GPIO4_C2_d) ; port ETH1G.RGMII_RST#
GMAC1_RXCK: U1.AJ2(CIF_D13/EBC_SDDO13/GMAC1_RXCLK_M1/UART7_RX_M2/PDM_SDI3_M1/GPIO4_A3_d) ; port ETH1G.RGMII_RXCK
GMAC1_RXD0: U1.1N1(CAM_CLKOUT0/EBC_SDCE1/GMAC1_RXD0_M1/SPI3_CS1_M0/I2S1_LRCK_RX_M1/GPIO4_A7_d)
GMAC1_RXD1: U1.1L2(CAM_CLKOUT1/EBC_SDCE2/GMAC1_RXD1_M1/SPI3_MISO_M0/I2S1_SDO1_M1/GPIO4_B0_d)
GMAC1_RXD2: U1.1P2(CIF_D11/EBC_SDDO11/GMAC1_RXD2_M1/PDM_SDI1_M1/GPIO4_A1_d)
GMAC1_RXD3: U1.1R1(CIF_D12/EBC_SDDO12/GMAC1_RXD3_M1/UART7_TX_M2/PDM_SDI2_M1/GPIO4_A2_d)
GMAC1_RXDV: U1.AG2(ISP_PRELIGHT_TRIG/EBC_SDCE3/GMAC1_RXDV_CRS_M1/I2S1_SDO2_M1/GPIO4_B1_d) ; port ETH1G.RGMII_RXDV
GMAC1_TXCK: U1.AK2(CIF_D10/EBC_SDDO10/GMAC1_TXCLK_M1/PDM_CLK1_M1/GPIO4_A0_d) ; port ETH1G.RGMII_TXCK
GMAC1_TXD0: U1.1N2(CIF_D14/EBC_SDDO14/GMAC1_TXD0_M1/UART9_TX_M2/I2S2_LRCK_TX_M1/GPIO4_A4_d)
GMAC1_TXD1: U1.AJ1(CIF_D15/EBC_SDDO15/GMAC1_TXD1_M1/UART9_RX_M2/I2S2_LRCK_RX_M1/GPIO4_A5_d)
GMAC1_TXD2: U1.AL2(CIF_D8/EBC_SDDO8/GMAC1_TXD2_M1/UART1_TX_M1/PDM_CLK0_M1/GPIO3_D6_d)
GMAC1_TXD3: U1.AL1(CIF_D9/EBC_SDDO9/GMAC1_TXD3_M1/UART1_RX_M1/PDM_SDI0_M1/GPIO3_D7_d)
GMAC1_TXEN: U1.AH2(ISP_FLASHTRIGOUT/EBC_SDCE0/GMAC1_TXEN_M1/SPI3_CS0_M0/I2S1_SCLK_RX_M1/GPIO4_A6_d) ; port ETH1G.RGMII_TXEN
GPIO0_A6: U1.AJ38(GPU_PWREN/SATA_CP_POD/GPIO0_A6_d) ; port GPIO0_A6
GPIO0_C7: U1.1V20(HDMITX_CEC_M1/PWM0_M1/UART0_CTSn/GPIO0_C7_d) ; port GPIO0_C7
GPIO0C1_JTAG_TDI: U1.1R18(PWM2_M0/NPUAVS/UART0_TX/MCU_JTAG_TDI/GPIO0_C1_d) ; port GPIOx16.GPIO0
GPIO0C2_JTAG_TMS: U1.AM37(PWM3_IR/EDP_HPDIN_M1/MCU_JTAG_TMS/GPIO0_C2_d) ; port EDP.EDP_HPD, port GPIOx16.GPIO1
GPIO0C3_JTAG_TRSTN: U1.AN38(PWM4/VOP_PWM_M0/MCU_JTAG_TRSTn/GPIO0_C3_d) ; port GPIOx16.GPIO2
GPIO1_A2: U1.A23(I2S1_MCLK_M0/UART3_RTSn_M0/SCR_CLK/GPIO1_A2_d) ; port GPIOx16.GPIO3
GPIO1_A3: U1.B23(I2S1_SCLK_TX_M0/UART3_CTSn_M0/SCR_IO/GPIO1_A3_d) ; port GPIOx16.GPIO4
GPIO1_A5: U1.B24(I2S1_LRCK_TX_M0/UART4_RTSn_M0/SCR_RST/GPIO1_A5_d) ; port GPIOx16.GPIO5
GPIO1_A7: U1.B25(I2S1_SDO0_M0/UART4_CTSn_M0/SCR_DET/AUDIOPWM_ROUT_N/GPIO1_A7_d) ; port GPIOx16.GPIO6
GPIO3_A1: U1.1U5(VOP_BT1120_D0/SPI1_CS0_M1/SDMMC2_D0_M1/GPIO3_A1_d) ; port GPIOx16.GPIO7
GPIO3_A7: U1.1V3(VOP_BT1120_D5/GMAC1_RXCLK_M0/SDMMC2_DET_M1/GPIO3_A7_d) ; port GPIOx16.GPIO8
GPIO3_B0: U1.AR7(VOP_BT1120_D6/ETH1_REFCLKO_25M_M0/SDMMC2_PWREN_M1/GPIO3_B0_d)
GPIO3_B3: U1.AP6(VOP_BT1120_D9/GMAC1_RXDV_CRS_M0/I2C5_SCL_M0/PDM_SDI0_M2/GPIO3_B3_d) ; port GPIOx16.GPIO9
GPIO3_B4: U1.1U3(VOP_BT1120_D10/GMAC1_RXER_M0/I2C5_SDA_M0/PDM_SDI1_M2/GPIO3_B4_d) ; port GPIOx16.GPIO10
GPIO3_B5: U1.1T4(VOP_BT1120_D11/GMAC1_TXD0_M0/I2C3_SCL_M1/PWM10_M0/GPIO3_B5_d) ; port GPIOx16.GPIO11
GPIO3_B6: U1.1V2(VOP_BT1120_D12/GMAC1_TXD1_M0/I2C3_SDA_M1/PWM11_IR_M0/GPIO3_B6_d) ; port GPIOx16.GPIO12
GPIO3_C1: U1.AP4(VOP_BT1120_D13/SPI1_MOSI_M1/PCIE20_PERSTn_M1/I2S1_SDO2_M2/GPIO3_C1_d) ; port GPIO3_C1
GPIO3_D0: U1.AP1(CIF_D2/EBC_SDDO2/SDMMC2_D2_M0/I2S1_LRCK_TX_M1/VOP_BT656_D2_M1/GPIO3_D0_d) ; port GPIOx16.GPIO13
GPIO3_D1: U1.AN2(CIF_D3/EBC_SDDO3/SDMMC2_D3_M0/I2S1_SDO0_M1/VOP_BT656_D3_M1/GPIO3_D1_d) ; port GPIOx16.GPIO14
GPIO3_D2: U1.AM2(CIF_D4/EBC_SDDO4/SDMMC2_CMD_M0/I2S1_SDI0_M1/VOP_BT656_D4_M1/GPIO3_D2_d) ; port GPIOx16.GPIO15
GPIO4_B2: U1.AF2(I2C4_SDA_M0/EBC_VCOM/GMAC1_RXER_M1/SPI3_MOSI_M0/I2S2_SDI_M1/GPIO4_B2_d) ; port GPIO4_B2
GPIO4_C3: U1.AP12(PWM15_IR_M1/SPI3_MOSI_M1/I2S3_SCLK_M1/GPIO4_C3_d) ; port GPIO4_C3
GPIO4_C5: U1.1U6(PWM12_M1/SPI3_MISO_M1/SATA1_ACT_LED/UART9_TX_M1/I2S3_SDO_M1/GPIO4_C5_d) ; port GPIO4_C5
GPIO4_C6: U1.1T6(PWM13_M1/SPI3_CS0_M1/SATA0_ACT_LED/UART9_RX_M1/I2S3_SDI_M1/GPIO4_C6_d) ; port GPIO4_C6
HDMI_REXT: R10.2 U1.1U16(HDMI_TX_REXT)
HDMI_TX0_N: U1.AR33(HDMI_TX_D0N) ; port HDMI.HDMI_TX0_N
HDMI_TX0_P: U1.AP33(HDMI_TX_D0P) ; port HDMI.HDMI_TX0_P
HDMI_TX1_N: U1.AP35(HDMI_TX_D1N) ; port HDMI.HDMI_TX1_N
HDMI_TX1_P: U1.AR35(HDMI_TX_D1P) ; port HDMI.HDMI_TX1_P
HDMI_TX2_N: U1.AR36(HDMI_TX_D2N) ; port HDMI.HDMI_TX2_N
HDMI_TX2_P: U1.AP36(HDMI_TX_D2P) ; port HDMI.HDMI_TX2_P
HDMI_TX_HPDIN: C60.1 U1.1V17(HDMI_TX_HPDIN) ; port HDMI.HDMI_TX_HPDIN
HDMI_TXCLK_N: U1.AP32(HDMI_TX_CLKN) ; port HDMI.HDMI_TXCLK_N
HDMI_TXCLK_P: U1.AR32(HDMI_TX_CLKP) ; port HDMI.HDMI_TXCLK_P
HDMITX_CEC: U1.1V5(HDMITX_CEC_M0/SPI3_CS1_M1/GPIO4_D1_u) ; port HDMI.HDMITX_CEC
HDMITX_SCL: U1.AR12(HDMITX_SCL/I2C5_SCL_M1/GPIO4_C7_u) ; port HDMI.HDMITX_SCL
HDMITX_SDA: U1.AP11(HDMITX_SDA/I2C5_SDA_M1/GPIO4_D0_u) ; port HDMI.HDMITX_SDA
HOST_WAKE_BT: U1.B36(I2S2_MCLK_M0/ETH0_REFCLKO_25M/UART7_RTSn_M0/SPI2_CLK_M0/GPIO2_C1_d) ; port HOST_WAKE_BT
I2C0_SCL_PMIC: U1.AJ37(I2C0_SCL/GPIO0_B1_u) ; port I2C0.I2C_SCL
I2C0_SDA_PMIC: U1.AK38(I2C0_SDA/GPIO0_B2_u) ; port I2C0.I2C_SDA
I2C1_SCL_JTAG_TDO: U1.AK37(I2C1_SCL/MCU_JTAG_TDO/GPIO0_B3_u) ; port I2C1.I2C_SCL
I2C1_SDA_JTAG_TCK: U1.AM38(I2C1_SDA/PCIE20_BUTTONRSTn/MCU_JTAG_TCK/GPIO0_B4_u) ; port I2C1.I2C_SDA
I2C2_SCL: U1.AD1(I2C2_SCL_M1/EBC_SDSHR/I2S1_SDO3_M1/GPIO4_B5_d) ; port I2C2.I2C_SDA
I2C2_SDA: U1.AF1(I2C2_SDA_M1/EBC_GDSP/ISP_FLASH_TRIGIN/VOP_BT656_CLK_M1/GPIO4_B4_d) ; port I2C2.I2C_SCL
I2C3_SCL_UART3_TX: U1.B22(I2C3_SCL_M0/UART3_TX_M0/AUDIOPWM_LOUT_N/GPIO1_A1_u) ; port I2C3.I2C_SCL
I2C3_SDA_UART3_RX: U1.A22(I2C3_SDA_M0/UART3_RX_M0/AUDIOPWM_LOUT_P/GPIO1_A0_u) ; port I2C3.I2C_SDA
I2S3_LRCK: U1.AR9(VOP_BT1120_D3/GMAC1_RXD2_M0/I2S3_LRCK_M0/SDMMC2_D3_M1/GPIO3_A4_d) ; port I2S3.I2S_LRCLK
I2S3_MCLK: U1.AR10(VOP_BT1120_D1/GMAC1_TXD2_M0/I2S3_MCLK_M0/SDMMC2_D1_M1/GPIO3_A2_d) ; port I2S3.I2S_MCLK
I2S3_SCLK: U1.AP10(VOP_BT1120_D2/GMAC1_TXD3_M0/I2S3_SCLK_M0/SDMMC2_D2_M1/GPIO3_A3_d) ; port I2S3.I2S_BCLK
I2S3_SDI: U1.1U4(VOP_BT1120_CLK/GMAC1_TXCLK_M0/I2S3_SDI_M0/SDMMC2_CLK_M1/GPIO3_A6_d) ; port I2S3.I2S_SDI
I2S3_SDO: U1.AP9(VOP_BT1120_D4/GMAC1_RXD3_M0/I2S3_SDO_M0/SDMMC2_CMD_M1/GPIO3_A5_d) ; port I2S3.I2S_SDO
LPDDR4_A_DQ0: U1.G2(DDR_DQ0_A/DDR4_DQL0_A/LPDDR4_DQ0_A/DDR3_DQ0/LPDDR3_DQ15)
LPDDR4_A_DQ1: U1.F2(DDR_DQ1_A/DDR4_DQL2_A/LPDDR4_DQ1_A/DDR3_DQ1/LPDDR3_DQ14)
LPDDR4_A_DQ2: U1.F1(DDR_DQ2_A/DDR4_DQL4_A/LPDDR4_DQ2_A/DDR3_DQ2/LPDDR3_DQ10)
LPDDR4_A_DQ3: U1.E1(DDR_DQ3_A/DDR4_DQL6_A/LPDDR4_DQ3_A/DDR3_DQ3/LPDDR3_DQ9)
LPDDR4_A_DQ4: U1.M2(DDR_DQ4_A/DDR4_DQL7_A/LPDDR4_DQ4_A/DDR3_DQ4/LPDDR3_DQ13)
LPDDR4_A_DQ5: U1.K1(DDR_DQ5_A/DDR4_DQL5_A/LPDDR4_DQ5_A/DDR3_DQ5/LPDDR3_DQ12)
LPDDR4_A_DQ6: U1.K2(DDR_DQ6_A/DDR4_DQL3_A/LPDDR4_DQ6_A/DDR3_DQ6/LPDDR3_DQ8)
LPDDR4_A_DQ7: U1.1E1(DDR_DQ7_A/DDR4_DQL1_A/LPDDR4_DQ7_A/DDR3_DQ7/LPDDR3_DQ11)
LPDDR4_A_DQ8: U1.P2(DDR_DQ8_A/DDR4_DQU3_A/LPDDR4_DQ8_A/DDR3_DQ8/LPDDR3_DQ25)
LPDDR4_A_DQ9: U1.R1(DDR_DQ9_A/DDR4_DQU1_A/LPDDR4_DQ9_A/DDR3_DQ9/LPDDR3_DQ24)
LPDDR4_A_DQ10: U1.R2(DDR_DQ10_A/DDR4_DQU7_A/LPDDR4_DQ10_A/DDR3_DQ10/LPDDR3_DQ28)
LPDDR4_A_DQ11: U1.T2(DDR_DQ11_A/DDR4_DQU5_A/LPDDR4_DQ11_A/DDR3_DQ11/LPDDR3_DQ29)
LPDDR4_A_DQ12: U1.M1(DDR_DQ12_A/DDR4_DQU2_A/LPDDR4_DQ12_A/DDR3_DQ12/LPDDR3_DQ26)
LPDDR4_A_DQ13: U1.1F2(DDR_DQ13_A/DDR4_DQU4_A/LPDDR4_DQ13_A/DDR3_DQ13/LPDDR3_DQ31)
LPDDR4_A_DQ14: U1.1F1(DDR_DQ14_A/DDR4_DQU6_A/LPDDR4_DQ14_A/DDR3_DQ14/LPDDR3_DQ30)
LPDDR4_A_DQ15: U1.1G2(DDR_DQ15_A/DDR4_DQU0_A/LPDDR4_DQ15_A/DDR3_DQ15/LPDDR3_DQ27)
LPDDR4_A_DQM0: U1.1E2(DDR_DM0_A/DDR4_DML_A/LPDDR4_DM0_A/DDR3_DM0/LPDDR3_DM1) ; port LPDDR4.LPDDR4_A_DQM0
LPDDR4_A_DQM1: U1.1G1(DDR_DM1_A/DDR4_DMU_A/LPDDR4_DM1_A/DDR3_DM1/LPDDR3_DM3) ; port LPDDR4.LPDDR4_A_DQM1
LPDDR4_A_DQS0_N: U1.H1(DDR_DQS0N_A/DDR4_DQSL_N_A/LPDDR4_DQS0N_A/DDR3_DQS0N/LPDDR3_DQS1N) ; port LPDDR4.LPDDR4_A_DQS0_N
LPDDR4_A_DQS0_P: U1.H2(DDR_DQS0P_A/DDR4_DQSL_P_A/LPDDR4_DQS0P_A/DDR3_DQS0P/LPDDR3_DQS1P) ; port LPDDR4.LPDDR4_A_DQS0_P
LPDDR4_A_DQS1_N: U1.N2(DDR_DQS1N_A/DDR4_DQSU_N_A/LPDDR4_DQS1N_A/DDR3_DQS1N/LPDDR3_DQS3N) ; port LPDDR4.LPDDR4_A_DQS1_N
LPDDR4_A_DQS1_P: U1.N1(DDR_DQS1P_A/DDR4_DQSU_P_A/LPDDR4_DQS1P_A/DDR3_DQS1P/LPDDR3_DQS3P) ; port LPDDR4.LPDDR4_A_DQS1_P
LPDDR4_B_DQ0: U1.B12(DDR_DQ0_B/DDR4_DQU7_B/LPDDR4_DQ0_B/DDR3_DQ16/LPDDR3_DQ1)
LPDDR4_B_DQ1: U1.B10(DDR_DQ1_B/DDR4_DQU5_B/LPDDR4_DQ1_B/DDR3_DQ17/LPDDR3_DQ5)
LPDDR4_B_DQ2: U1.1A8(DDR_DQ2_B/DDR4_DQU3_B/LPDDR4_DQ2_B/DDR3_DQ18/LPDDR3_DQ6)
LPDDR4_B_DQ3: U1.1A7(DDR_DQ3_B/DDR4_DQU1_B/LPDDR4_DQ3_B/DDR3_DQ19/LPDDR3_DQ4)
LPDDR4_B_DQ4: U1.B13(DDR_DQ4_B/DDR4_DQU0_B/LPDDR4_DQ4_B/DDR3_DQ20/LPDDR3_DQ2)
LPDDR4_B_DQ5: U1.1A10(DDR_DQ5_B/DDR4_DQU6_B/LPDDR4_DQ5_B/DDR3_DQ21/LPDDR3_DQ3)
LPDDR4_B_DQ6: U1.1B9(DDR_DQ6_B/DDR4_DQU4_B/LPDDR4_DQ6_B/DDR3_DQ22/LPDDR3_DQ7)
LPDDR4_B_DQ7: U1.1A9(DDR_DQ7_B/DDR4_DQU2_B/LPDDR4_DQ7_B/DDR3_DQ23/LPDDR3_DQ0)
LPDDR4_B_DQ8: U1.B19(DDR_DQ8_B/DDR4_DQL0_B/LPDDR4_DQ8_B/DDR3_DQ24/LPDDR3_DQ18)
LPDDR4_B_DQ9: U1.A19(DDR_DQ9_B/DDR4_DQL2_B/LPDDR4_DQ9_B/DDR3_DQ25/LPDDR3_DQ19)
LPDDR4_B_DQ10: U1.A20(DDR_DQ10_B/DDR4_DQL4_B/LPDDR4_DQ10_B/DDR3_DQ26/LPDDR3_DQ22)
LPDDR4_B_DQ11: U1.B20(DDR_DQ11_B/DDR4_DQL6_B/LPDDR4_DQ11_B/DDR3_DQ27/LPDDR3_DQ23)
LPDDR4_B_DQ12: U1.A15(DDR_DQ12_B/DDR4_DQL7_B/LPDDR4_DQ12_B/DDR3_DQ28/LPDDR3_DQ16)
LPDDR4_B_DQ13: U1.B15(DDR_DQ13_B/DDR4_DQL5_B/LPDDR4_DQ13_B/DDR3_DQ29/LPDDR3_DQ17)
LPDDR4_B_DQ14: U1.1C10(DDR_DQ14_B/DDR4_DQL1_B/LPDDR4_DQ14_B/DDR3_DQ30/LPDDR3_DQ20)
LPDDR4_B_DQ15: U1.B16(DDR_DQ15_B/DDR4_DQL3_B/LPDDR4_DQ15_B/DDR3_DQ31/LPDDR3_DQ21)
LPDDR4_B_DQM0: U1.1B8(DDR_DM0_B/DDR4_DMU_B/LPDDR4_DM0_B/DDR3_DM2/LPDDR3_DM0) ; port LPDDR4.LPDDR4_B_DQM0
LPDDR4_B_DQM1: U1.1A11(DDR_DM1_B/DDR4_DML_B/LPDDR4_DM1_B/DDR3_DM3/LPDDR3_DM2) ; port LPDDR4.LPDDR4_B_DQM1
LPDDR4_B_DQS0_N: U1.A12(DDR_DQS0N_B/DDR4_DQSU_N_B/LPDDR4_DQS0N_B/DDR3_DQS2N/LPDDR3_DQS0N) ; port LPDDR4.LPDDR4_B_DQS0_N
LPDDR4_B_DQS0_P: U1.A13(DDR_DQS0P_B/DDR4_DQSU_P_B/LPDDR4_DQS0P_B/DDR3_DQS2P/LPDDR3_DQS0P) ; port LPDDR4.LPDDR4_B_DQS0_P
LPDDR4_B_DQS1_N: U1.B17(DDR_DQS1N_B/DDR4_DQSL_N_B/LPDDR4_DQS1N_B/DDR3_DQS3N/LPDDR3_DQS2N) ; port LPDDR4.LPDDR4_B_DQS1_N
LPDDR4_B_DQS1_P: U1.A17(DDR_DQS1P_B/DDR4_DQSL_P_B/LPDDR4_DQS1P_B/DDR3_DQS3P/LPDDR3_DQS2P) ; port LPDDR4.LPDDR4_B_DQS1_P
LPDDR4_CAA0: U1.C2(DDR4_A11/LPDDR4_A0_A/DDR3_A7/LPDDR3_A8/AC11)
LPDDR4_CAA1: U1.C1(DDR4_A2/LPDDR4_A1_A/DDR3_A4/LPDDR3_A6/AC2)
LPDDR4_CAA2: U1.1C1(DDR4_A15_CASn/LPDDR4_A2_A/DDR3_A0/-/AC15)
LPDDR4_CAA3: U1.1B3(DDR4_A12/LPDDR4_A3_A/DDR3_BA2/-/AC12)
LPDDR4_CAA4: U1.1B1(DDR4_A14_WEn/LPDDR4_A4_A/DDR3_A15/LPDDR3_A5/AC14)
LPDDR4_CAA5: U1.1A1(DDR4_A16_RASn/LPDDR4_A5_A/DDR3_RASn/LPDDR3_A7/AC16)
LPDDR4_CAB0: U1.A9(DDR4_A13/LPDDR4_A0_B/DDR3_A14/LPDDR3_A0/AC13)
LPDDR4_CAB1: U1.B9(DDR4_A6/LPDDR4_A1_B/DDR3_A13/LPDDR3_A1/AC6)
LPDDR4_CAB2: U1.1B7(DDR4_BA0/LPDDR4_A2_B/DDR3_A1/-/AC18)
LPDDR4_CAB3: U1.1B6(DDR4_A4/LPDDR4_A3_B/DDR3_BA1/LPDDR3_A3/AC4)
LPDDR4_CAB4: U1.1A6(DDR4_BA1/LPDDR4_A4_B/DDR3_A12/LPDDR3_A4/AC19)
LPDDR4_CAB5: U1.B8(DDR4_A5/LPDDR4_A5_B/DDR3_A11/LPDDR3_A2/AC5)
LPDDR4_CKEA0: U1.B4(DDR4_CKE/LPDDR4_CKE0_A/DDR3_CKE/LPDDR3_CKE/AC22)
LPDDR4_CKEA1: U1.1C3(DDR4_A3/LPDDR4_CKE1_A/DDR3_A3/-/AC3)
LPDDR4_CKEB0: U1.1A3(DDR4_A10/LPDDR4_CKE0_B/DDR3_A10/-/AC10)
LPDDR4_CKEB1: U1.1A2(DDR4_ACTn/LPDDR4_CKE1_B/DDR3_CASn/-/AC17)
LPDDR4_CLKA_N: U1.B5(DDR4_CLKN/LPDDR4_CLKN_A/DDR3_CLKN/LPDDR3_CLKN/AC24) ; port LPDDR4.LPDDR4_CLKA_N
LPDDR4_CLKA_P: U1.A5(DDR4_CLKP/LPDDR4_CLKP_A/DDR3_CLKP/LPDDR3_CLKP/AC23) ; port LPDDR4.LPDDR4_CLKA_P
LPDDR4_CLKB_N: U1.B7(DDR4_A9/LPDDR4_CLKN_B/DDR3_A5/-/AC9) ; port LPDDR4.LPDDR4_CLKB_N
LPDDR4_CLKB_P: U1.A7(DDR4_A0/LPDDR4_CLKP_B/DDR3_A9/-/AC0) ; port LPDDR4.LPDDR4_CLKB_P
LPDDR4_CSA0: U1.B3(DDR4_CS0n/LPDDR4_CS0n_A/DDR3_ODT1/LPDDR3_ODT0/AC25)
LPDDR4_CSA1: U1.A3(DDR4_CS1n/LPDDR4_CS1n_A/DDR3_CS1n/LPDDR3_ODT1/AC26)
LPDDR4_CSB0: U1.1B5(DDR4_ODT1/LPDDR4_CS0n_B/DDR3_CS0n/LPDDR3_CS0n/AC28)
LPDDR4_CSB1: U1.1A5(DDR4_ODT0/LPDDR4_CS1n_B/DDR3_ODT0/LPDDR3_CS1n/AC27)
LPDDR4_ODT_CAA: U1.E2(DDR4_A8/LPDDR4_ODT0_CA_A/DDR3_A6/LPDDR3_A9/AC8) ; port LPDDR4.LPDDR4_ODT_CAA
LPDDR4_ODT_CAB: U1.A10(DDR4_A7/LPDDR4_ODT0_CA_B/DDR3_A8/-/AC7) ; port LPDDR4.LPDDR4_ODT_CAB
LPDDR4_RST#: U1.1C7(DDR4_RESETn/LPDDR4_RESETn/DDR3_RESETn/AC29) ; port LPDDR4.LPDDR4_RST#
LPDDR4_RZQ: R4.2 U1.1F3(DDR_RZQ)
MIC_PDM_CLK0: U1.1A14(I2S1_LRCK_RX_M0/UART4_TX_M0/PDM_CLK0_M0/AUDIOPWM_ROUT_P/GPIO1_A6_d) ; port MIC_PDM.MIC_PDM_CLK0
MIC_PDM_SDI0: U1.1B14(I2S1_SDI0_M0/PDM_SDI0_M0/GPIO1_B3_d) ; port MIC_PDM.MIC_PDM_SDI0
MIC_PDM_SDI1: U1.B26(I2S1_SDO3_M0/I2S1_SDI1_M0/PDM_SDI1_M0/PCIE20_PERSTn_M2/GPIO1_B2_d) ; port MIC_PDM.MIC_PDM_SDI1
MIC_PDM_SDI2: U1.A26(I2S1_SDO2_M0/I2S1_SDI2_M0/PDM_SDI2_M0/PCIE20_WAKEn_M2/GPIO1_B1_d) ; port MIC_PDM.MIC_PDM_SDI2
MIC_PDM_SDI3: U1.1B13(I2S1_SDO1_M0/I2S1_SDI3_M0/PDM_SDI3_M0/PCIE20_CLKREQn_M2/GPIO1_B0_d) ; port MIC_PDM.MIC_PDM_SDI3
PCIE_REFCLK_N: U1.1K20(PCIE20_REFCLKN) ; port PCIeCLK.PCIE_REFCLK_N
PCIE_REFCLK_P: U1.1K19(PCIE20_REFCLKP) ; port PCIeCLK.PCIE_REFCLK_P
PCIE_RX_N: U1.AB38(PCIE20_RXN/SATA2_RXN) ; port PCIEx1L.PCIE_RX_N
PCIE_RX_P: U1.AB37(PCIE20_RXP/SATA2_RXP) ; port PCIEx1L.PCIE_RX_P
PCIE_TX_N: U1.AA38(PCIE20_TXN/SATA2_TXN) ; port PCIEx1L.PCIE_TX_N
PCIE_TX_P: U1.AA37(PCIE20_TXP/SATA2_TXP) ; port PCIEx1L.PCIE_TX_P
PDM_CLK1: U1.1A13(I2S1_SCLK_RX_M0/UART4_RX_M0/PDM_CLK1_M0/SPDIF_TX_M0/GPIO1_A4_d) ; port PDM_CLK1
PMIC32KO_SOC: U1.1T20(CLK32K_IN/CLK32K_OUT0/GPIO0_B0_u) ; port PMIC32KO_SOC
PMIC_INT_L: U1.1R19(GPIO0_A3_u) ; port PMIC_INT_L
PMIC_SLEEP: U1.1P19(PMIC_SLEEP/TSADC_SHUT_M1/GPIO0_A2_d) ; port PMIC_SLEEP
PWM0_M0: U1.1R17(PWM0_M0/CPUAVS/GPIO0_B7_d) ; port PWM0
PWM7_IR: U1.1T18(PWM7_IR/SPI0_CS0_M0/GPIO0_C6_d) ; port PWM7_IR
PWM11_IR_M1: U1.AB2(CIF_CLKOUT/EBC_GDCLK/PWM11_IR_M1/GPIO4_C0_d) ; port PWM11_IR
QSPI_D0: U1.1A17(FSPI_D0/FLASH_RDY/GPIO1_D1_u)
QSPI_D1: U1.1A18(FSPI_D1/FLASH_RDn/GPIO1_D2_u)
QSPI_D2: U1.1B16(EMMC_RSTn/FSPI_D2/FLASH_WPn/GPIO1_C7_d)
QSPI_D3: U1.1C15(FSPI_D3/FLASH_CS1n/GPIO1_D4_u)
QSPI_SCK: U1.1A15(FSPI_CLK/FLASH_ALE/GPIO1_D0_d) ; port QSPI.QSPI_SCK
QSPI_SS#: U1.1B17(FSPI_CS0n/FLASH_CS0n/GPIO1_D3_u) ; port QSPI.QSPI_SS#
REFCLKO_25M: R11.1 ; port ETH1G.REFCLKO_25M
RESET#: C4.2 R1.2 R2.1 U1.AG38(nPOR_u)
SDMMC0_CLK: R6.1 ; port SDCARD.SDMMC_CLK
SDMMC0_CMD: U1.1E19(SDMMC0_CMD/PWM10_M1/UART5_RX_M0/GPIO2_A1_u) ; port SDCARD.SDMMC_CMD
SDMMC0_D0: U1.1E20(SDMMC0_D0/UART2_TX_M1/UART6_TX_M1/PWM8_M1/GPIO1_D5_u)
SDMMC0_D1: U1.1F19(SDMMC0_D1/UART2_RX_M1/UART6_RX_M1/PWM9_M1/GPIO1_D6_u)
SDMMC0_D2: U1.1D20(SDMMC0_D2/ARM_JTAG_TCK/UART5_CTSn_M0/GPIO1_D7_u)
SDMMC0_D3: U1.1F18(SDMMC0_D3/ARM_JTAG_TMS/UART5_RTSn_M0/GPIO2_A0_u)
SDMMC0_DET: U1.AF37(SDMMC0_DET/SATA_CP_DET/GPIO0_A4_u) ; port SDCARD_DET
SDMMC0_PWREN: U1.AG37(SDMMC0_PWREN/SATA_MP_SWITCH/PCIE20_CLKREQn_M0/GPIO0_A5_d)
SPDIF_TX: U1.1V6(EDP_HPDIN_M0/SPDIF_TX_M2/SATA2_ACT_LED/I2S3_LRCK_M1/GPIO4_C4_d) ; port SPDIF_TX
SPI0_CS1: U1.AN37(PWM5/SPI0_CS1_M0/UART0_RTSn/GPIO0_C4_d) ; port SPI0.SPI_SS#
SPI0_MISO: U1.1U19(PWM6/SPI0_MISO_M0/GPIO0_C5_d) ; port SPI0.SPI_MISO
SPI0_MOSI: U1.1R16(I2C2_SDA_M0/SPI0_MOSI_M0/PCIE20_PERSTnM0/PWM2_M1/GPIO0_B6_u) ; port SPI0.SPI_MOSI
SPI0_SCK: U1.1U20(I2C2_SCL_M0/SPI0_CLK_M0/PCIE20_WAKEn_M0/PWM1_M1/GPIO0_B5_u) ; port SPI0.SPI_SCK
STATUS_LED: R14.2 U1.1P18(REFCLK_OUT/GPIO0_A0_d)
TSADC_SHUT_M0: R2.2 U1.1R20(TSADC_SHUT_M0/TSADC_SHUT_ORG/GPIO0_A1_z)
UART2_RX_M0_DEBUG: D4.2 U1.1V19(UART2_RX_M0/GPIO0_D0_u)
UART2_TX_M0_DEBUG: J1.2 U1.1U18(UART2_TX_M0/GPIO0_D1_u)
UART3_RX: U1.AR4(PWM13_M0/GMAC1_MCLKINOUT_M0/UART3_RX_M1/PDM_SDI3_M2/GPIO3_C0_d) ; port UART3.UART_RX
UART3_TX: U1.AP5(PWM12_M0/GMAC1_TXEN_M0/UART3_TX_M1/PDM_SDI2_M2/GPIO3_B7_d) ; port UART3.UART_TX
UART4_RX: U1.AP7(VOP_BT1120_D7/GMAC1_RXD0_M0/UART4_RX_M1/PWM8_M0/GPIO3_B1_d) ; port UART4.UART_RX
UART4_TX: U1.AR6(VOP_BT1120_D8/GMAC1_RXD1_M0/UART4_TX_M1/PWM9_M0/GPIO3_B2_d) ; port UART4.UART_TX
UART5_RX: U1.AR2(VOP_BT1120_D15/SPI1_CLK_M1/UART5_RX_M1/I2S1_SCLK_RX_M2/GPIO3_C3_d) ; port UART5.UART_RX
UART5_TX: U1.AP3(VOP_BT1120_D14/SPI1_MISO_M1/UART5_TX_M1/I2S1_SDO3_M2/GPIO3_C2_d) ; port UART5.UART_TX
UART7_RX: U1.1P4(PWM15_IR_M0/SPDIF_TX_M1/GMAC1_MDIO_M0/UART7_RX_M1/I2S1_LRCK_RX_M2/GPIO3_C5_d) ; port UART7.UART_RX
UART7_TX: U1.1P3(PWM14_M0/VOP_PWM_M1/GMAC1_MDC_M0/UART7_TX_M1/PDM_CLK1_M2/GPIO3_C4_d) ; port UART7.UART_TX
URT_BTCTS_MRTS: U1.F37(UART1_RTSn_M0/SPI1_CLK_M0/GPIO2_B5_u) ; port BTURT_BTCTS_MRTS
URT_BTRTS_MCTS: U1.G37(UART1_CTSn_M0/SPI1_MISO_M0/GPIO2_B6_u) ; port BTURT_BTRTS_MCTS
URT_BTRX_MTX: U1.F38(UART1_TX_M0/GPIO2_B4_u) ; port BTUART.UART_TX
URT_BTTX_MRX: U1.1C20(UART1_RX_M0/GPIO2_B3_u) ; port BTUART.UART_RX
USB3_HST1_D_N: U1.1J20(USB3_HOST1_DM) ; port USB3_HST1.USB3_D_N
USB3_HST1_D_P: U1.1J19(USB3_HOST1_DP) ; port USB3_HST1.USB3_D_P
USB3_HST1_SSRX_N: U1.V37(USB3_HOST1_SSRXN/SATA1_RXN) ; port USB3_HST1.USB3_SSRX_N
USB3_HST1_SSRX_P: U1.V38(USB3_HOST1_SSRXP/SATA1_RXP) ; port USB3_HST1.USB3_SSRX_P
USB3_HST1_SSTX_N: U1.W38(USB3_HOST1_SSTXN/SATA1_TXN) ; port USB3_HST1.USB3_SSTX_N
USB3_HST1_SSTX_P: U1.W37(USB3_HOST1_SSTXP/SATA1_TXP) ; port USB3_HST1.USB3_SSTX_P
USB_HST2_D_N: U1.V1(USB_HOST2_DM) ; port USB_HST2.USB_D_N
USB_HST2_D_P: U1.V2(USB_HOST2_DP) ; port USB_HST2.USB_D_P
USB_HST3_D_N: U1.Y1(USB_HOST3_DM) ; port USB_HST3.USB_D_N
USB_HST3_D_P: U1.Y2(USB_HOST3_DP) ; port USB_HST3.USB_D_P
USB_OTG0_D_N: U1.R38(USB_OTG0_DM) ; port USB_OTG0.USB_D_N
USB_OTG0_D_P: U1.R37(USB_OTG0_DP) ; port USB_OTG0.USB_D_P
USBOTG0_ID: TP1.1 U1.T37(USB_OTG0_ID) ; port USBOTG0_ID
USBOTG_VBUS: R18.1 ; port USBOTG_VBUS
USBOTG_VBUSDET: C34.1 R18.2 R19.1 U1.T38(USB_OTG0_VBUSDET)
VREFO_DDR: C9.2 C11.1 U1.1H3(DDR_VREFOUT)
WIFI_REG_ON: U1.A35(SDMMC1_PWREN/I2C4_SDA_M1/UART8_RTSn_M0/GPIO2_B1_d) ; port WIFI_REG_ON
WIFI_WAKE_HOST: U1.B34(SDMMC1_DET/I2C4_SCL_M1/UART8_CTSn_M0/GPIO2_B2_u) ; port WIFI_WAKE_HOST
WL_SD_CLK: U1.B37(SDMMC1_CLK/UART9_TX_M0/GPIO2_B0_d) ; port WIFISD.SDMMC_CLK
WL_SD_CMD: U1.B35(SDMMC1_CMD/UART9_RX_M0/GPIO2_A7_u) ; port WIFISD.SDMMC_CMD
WL_SD_D0: U1.1C19(SDMMC1_D0/UART6_RX_M0/GPIO2_A3_u)
WL_SD_D1: U1.1E18(SDMMC1_D1/UART6_TX_M0/GPIO2_A4_u)
WL_SD_D2: U1.1D18(SDMMC1_D2/UART7_RX_M0/GPIO2_A5_u)
WL_SD_D3: U1.1A20(SDMMC1_D3/UART7_TX_M0/GPIO2_A6_u)
WORKING_LED: R15.2 U1.1T19(PWM1_M0/GPUAVS/UART0_RX/GPIO0_C0_d)
XIN24M: R16.2 R17.1 U1.AD37(XIN24M)
XOUT24M: C3.1 R17.2 U1.AD38(XOUT24M) X1.3
NetC2_1: C2.1 R16.1 X1.1
NetC12_1: C12.1 FB1.2 U1.1D16(SARADC_AVDD_1V8)
NetC78_2: C78.2 R20.2 U1.1N9(MIPI_CSI_RX_AVDD_0V9)
NetC80_2: C80.2 R21.2 U1.1P9(MIPI_CSI_RX_AVDD_1V8)
NetC?#2_2: C?#2.2 R?#1.2 U1.1P11(MIPI_DSI_TX0/LVDS_TX0_AVDD_0V9)
NetC?#4_2: C?#4.2 R?#2.2 U1.1P12(MIPI_DSI_TX0/LVDS_TX0_AVDD_1V8)
NetD1_1: D1.1(ANODE) R14.1
NetD3_1: D3.1(ANODE) R15.1
NetD4_1: D4.1 J1.1
NetR3_2: R3.2 U1.A29(EMMC_CLKOUT/FLASH_DQS/GPIO1_C5_d)
NetR6_2: R6.2 U1.G38(SDMMC0_CLK/TEST_CLKOUT/UART5_TX_M0/GPIO2_A2_d)
NetR11_2: R11.2 U1.AE2(I2C4_SCL_M0/EBC_GDOE/ETH1_REFCLKO_25M_M1/SPI3_CLK_M0/I2S2_SDO_M1/GPIO4_B3_d)
NetR12_1: R12.1 U1.1M18(TVSS)

Not connected (* = marked no-connect by the designer): U1 1A4(DDR4_BG0/LPDDR4_ODT1_CA_B/DDR3_WEn/-/AC20)* 1C2(DDR4_BG1/LPDDR4_ODT1_CA_A/DDR3_BA0/-/AC21)* 1D2(DDR4_A1/-/DDR3_A2/-/AC1)* 1M19(GPIO0_D4_d) 1N19(GPIO0_D3_d) 1N20(GPIO0_D5_d) 1P20(GPIO0_D6_d) 1R2(CIF_D6/EBC_SDDO6/SDMMC2_DET_M0/I2S1_SDI2_M1/VOP_BT656_D6_M1/GPIO3_D4_d) 1T1(CIF_D7/EBC_SDDO7/SDMMC2_PWREN_M0/I2S1_SDI3_M1/VOP_BT656_D7_M1/GPIO3_D5_d) 1T2(CIF_D0/EBC_SDDO0/SDMMC2_D0_M0/I2S1_MCLK_M1/VOP_BT656_D0_M1/GPIO3_C6_d) 1U1(CIF_D1/EBC_SDDO1/SDMMC2_D1_M0/I2S1_SCLK_TX_M1/VOP_BT656_D1_M1/GPIO3_C7_d) 1U8(MIPI_CSI_RX_CLK1N) 1U11(MIPI_DSI_TX1_CLKN) 1V8(MIPI_CSI_RX_CLK1P) 1V11(MIPI_DSI_TX1_CLKP) AP20(MIPI_DSI_TX1_D3N) AP21(MIPI_DSI_TX1_D2P) AP23(MIPI_DSI_TX1_D1N) AP24(MIPI_DSI_TX1_D0P) AR20(MIPI_DSI_TX1_D3P) AR21(MIPI_DSI_TX1_D2N) AR23(MIPI_DSI_TX1_D1P) AR24(MIPI_DSI_TX1_D0N)

## Buses and harness runs
bus EMMC_D[0..3]
bus EMMC_D[4..7] = port EMMC_D[4..7]
bus GMAC1_RXD[0..3]
bus GMAC1_TXD[0..3]
bus LPDDR4_A_DQ[0..7]
bus LPDDR4_A_DQ[8..15]
bus LPDDR4_B_DQ[0..7]
bus LPDDR4_B_DQ[8..15]
bus LPDDR4_CAA[0..5]
bus LPDDR4_CAB[0..5]
bus LPDDR4_CKEA[0..1]
bus LPDDR4_CKEB[0..1]
bus LPDDR4_CSA[0..1]
bus LPDDR4_CSB[0..1]
bus QSPI_D[0..3]
bus SDMMC0_D[0..3]
bus WL_SD_D[0..3]

## Notes on the sheet
- 1.8v LEVEL IO
- EMMC NAND FLASH
- ETHERNET PHY
- SD CARD
- (near S1) per PDM SDI is for 2 digital microphone channels (Left and Right channel)
- (near R13) USB3HST_PWREN
- H: VCCIO2 1.8v
- L: VCCIO2 3.3v
- CPU - WIFI
- (near S1) for put the system into Maskrom mode to update the firmware
- (near S1) Maskrom
- WIFI
- BT DATA
- eMMC Nand Flash
- BT AUDIO
- QSPI FLASH
- ETHERNET1G
- VDDA1V8
- SOC output - WIFI input
- micro SD memory
- GPIO2_B1
- GPIO2_B2
- (near D2) Bootloader
- GPIO2_C0
- GPIO2_B7
- WIFI BT
- GPIO2_C1
- BLUETOOTH
- POWERs NET NAME: VDDR
- CPU - RAM
- CPU - PCIE
- POWERs NET NAME: VCPU, VGNL, VDD0V9, VDDA1V8
- CPU - USB
- tie to GND: Default Host, Float: Default Device
- VDD_CPU: 0.95v
- (near C43) VDD0V9
- CPU - HDMI
- DisplayPort
- EDP_HPD
- MIPI-DSI
- MIPI-CSI
- VIMG0V9
- VIMG1V8
- (in symbol RK3566_BGA565, part A) 3.3V; 1.8V/3.3V
- (in symbol RK3566_BGA565, part B) 1.8V/3.3V
- (in symbol RK3566_BGA565, part C) 1.8V/3.3V
- (in symbol RK3566_BGA565, part D) PCIE/SATA; USB; HDMI2.0_TX; DisplayPort_TX
- (in symbol RK3566_BGA565, part E) MIPI_CSI; MIPI_DSI
- (in symbol RK3566_BGA565, part F) DDR PHY
- (in symbol RK3566_BGA565, part G) POWER pins
- (in symbol RK3566_BGA565, part H) GND pins

## Library data of the parts
C1 C4 C5 C7 C8 C10 C12 C14-C16 C24 C26 C28-C36 C42 C44 C47 C54 C55 C58-C60 C62 C63 C65 C69 C70 C73 C74 C78 C80 C?#2 C?#4 = CAP_SMD_MLCC: CAP, MLCC; PARAM: X5R, 10%; MANF_P#: CL03A104KP3NNWC; MANF: Samsung; PARAM2: 10v; PRICE: 10,000:$0.006; ASSEMBLY: ASSEMBLY; VALUE: 0.1uF
C2 C3 = CAP_SMD_MLCC: CAP, MLCC; PARAM: C0G, 5%; MANF_P#: CC0402JRNPO9BN180; MANF: Yageo; PARAM2: 50v; PRICE: 100: 0.009$; ASSEMBLY: ASSEMBLY; VALUE: 10pF
C6 C17 C18 C25 C27 C40 C41 C46 C53 C57 C64 C67 C68 C72 = CAP_SMD_MLCC: CAP, MLCC; PARAM: X5R, 20%; MANF_P#: CL03A475MQ5C65C; MANF: Samsung; PARAM2: 6.3v; PRICE: 10,000:	$0.013; ASSEMBLY: ASSEMBLY; VALUE: 4.7uF
C9 C11 C20-C23 = CAP_SMD_MLCC: CAP, MLCC; PARAM: X7R, 10%; MANF_P#: CC0201KRX7R7BB102; MANF: Yageo; PARAM2: 16v; PRICE: 100: 0.03$; ASSEMBLY: ASSEMBLY; VALUE: 1000pF
C13 C43 C45 C56 C71 C77 C79 C?#1 C?#3 = CAP_SMD_MLCC: CAP, MLCC; PARAM: X5R, 20%; MANF_P#: CL03A105MQ3CSNC; MANF: Samsung; PARAM2: 6.3v; PRICE: 50,000:	$0.006; ASSEMBLY: ASSEMBLY; VALUE: 1uF
C19 C50 C51 C76 = CAP_SMD_MLCC: CAP, MLCC; PARAM: X5R, 20%; MANF_P#: CL05A106MP5NUNC; MANF: Samsung; PARAM2: 10v; PRICE: 10,000: $0.034; ASSEMBLY: ASSEMBLY; VALUE: 10uF
C37-C39 C48 C49 C52 C61 C66 C75 = CAP_SMD_MLCC: CAP, MLCC; PARAM: X5R, 10%; MANF_P#: GRM158R61A226ME15; MANF: Murata; PARAM2: 10v; PRICE: 8,000: $0.124; ASSEMBLY: ASSEMBLY; VALUE: 22uF
D1 = LED_SMD_0603_GRN_OSRAM: LED, SMD, 0603, GREEN; PARAM: 20mA; MANF: OSRAM; DESC: DESCRIPTION; MANF_P#: LG Q396-PS-35; PARAM2: 2.2V; ASSEMBLY: ASSEMBLY; PRICE: 0.36$; VALUE: LED603GRN
D2 = TVS_PESDNC2FD3V3: TVS, ESD PROTECT, Bidirectional; MANF_P#: PESDNC2FD3V3BS; PARAM2: 3.3vb, 10.5vr; MANF: -; PRICE: 0.7$; VALUE: TVS_PESDNC2FD3V3
D3 = LED_SMD_0603_RED: LED, SMD, 0603, RED; PARAM: 30mA, 640nm; DESC: DESCRIPTION; PARAM2: 1.8~2.5V; MANF: -; ASSEMBLY: ASSEMBLY; PRICE: PRICE; MANF_P#: -; VALUE: LED603RED
D4 = DIODE_SMD_SD103AWS_SOD323: DIODE, 0.2A; MANF: Diodes; DESC: DESCRIPTION; PARAM: 200mA; PARAM2: 40V; ASSEMBLY: ASSEMBLY; PRICE: 0.2$; MANF_P#: SD103AWS; VALUE: SD103AWS
FB1 = FBEAD_SMD_BLM15PD121: FERRITE_Bead, 0402, 0.5A, 200mOhm, 120@100MHz; MANF: MURATA; MANF_P#: BLM15AG121SN1D; PARAM: 120@100MHz; PARAM2: 0.5A, 200mOhm; VALUE: FB402
J1 = XH_3: JST-XH pitch: 2.5mm; VALUE: HHDR_3; MANF: -; MANF_P#: -
R1-R21 R?#1 R?#2 = RES_SMD: RESISTOR, SMD; PARAM: 0.063W; DESC: DESCRIPTION; DIST#: MOUSER; PARAM2: 1%; MANF_P#: -; MANF: -; ASSEMBLY: ASSEMBLY; PRICE: 100= 0.3$
  R1 R5 R7-R9 R13 R18 R19: VALUE: 10k
  R2 R12: VALUE: 0
  R3 R6 R11: VALUE: 22
  R4: VALUE: 120
  R10: VALUE: 1.62k
  R14 R15: VALUE: 1k
  R16: VALUE: 100
  R17: VALUE: 1M
  R20 R21 R?#1 R?#2: VALUE: 1R
S1 = SWPBS_SPST_3X2_B3U-1000P: SWITCH, PUSH BUTTON, TACTILE, SMD, SPST, 3X2.5X1.2mm; MANF: OMRON; DESC: DESCRIPTION; VALUE: PUSHBUTTON; ASSEMBLY: ASSEMBLY; PARAM: PARAM; PRICE: PRICE; MANF_P#: B3U-1000P
S2 = SWPBS_SPDT_R_SKRTLA: SWITCH, PUSH BUTTON, TACTILE, THD, SPDT, RIGHT; MANF: ALPS, E-SWITCH, LEYE; PARAM: 20mA/15VDC; DESC: DESCRIPTION; MANF_P#: SKRTLAE010, TL3340, LY-A05-S1; VALUE: PUSHBUTTON; ASSEMBLY: ASSEMBLY; PRICE: 0.05$
TP1 = TESTPOINT_SMD: TEST POINT; MANF: MANF; MANF_P#: MANF_P#; VALUE: VALUE
U1 = RK3566_BGA565: Processor, Cortex-A55 x4; MANF: Rockchip; PARAM: 4x Cortex-A55; VALUE: RK3566; MANF_P#: RK3566; PRICE: 10$
X1 = XTL_4_24MHz_3225: Crystal 24MHz; MANF: Murata; MANF_P#: XRCGB24M000F1H17R0; PARAM2: 10PPM, 6pF; PARAM: -20~70oC; PRICE: 0.4$; VALUE: 24MHz